# Altium project Strawberry Pi.PrjPcb (part 1 of 2)
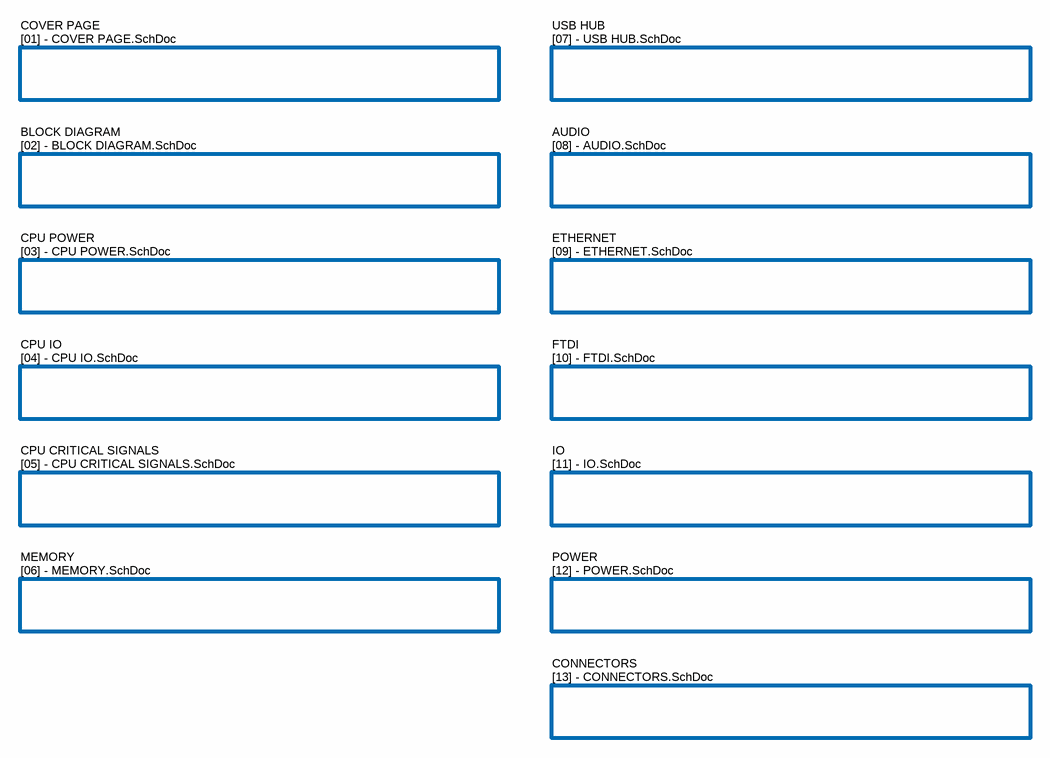
[diagram p0: Strawberry Pi.SchDoc]
15 sheets, 249 parts. Net scope: flat (ports and power ports of the same name join across sheets).
Board file: Strawberry Pi.PcbDoc
Sheets:
  Strawberry Pi.SchDoc
    COVER PAGE = [01] - COVER PAGE.SchDoc
    BLOCK DIAGRAM = [02] - BLOCK DIAGRAM.SchDoc
    CPU POWER = [03] - CPU POWER.SchDoc
    CPU IO = [04] - CPU IO.SchDoc
    CPU CRITICAL SIGNALS = [05] - CPU CRITICAL SIGNALS.SchDoc
    MEMORY = [06] - MEMORY.SchDoc
    USB HUB = [07] - USB HUB.SchDoc
    AUDIO = [08] - AUDIO.SchDoc
    ETHERNET = [09] - ETHERNET.SchDoc
    FTDI = [10] - FTDI.SchDoc
    IO = [11] - IO.SchDoc
    POWER = [12] - POWER.SchDoc
    CONNECTORS = [13] - CONNECTORS.SchDoc
  [14] - CO-PROCESSOR.SchDoc

## Sheet Strawberry Pi.SchDoc: Strawberry Pi
size A4; Organization: Bjørn T. Brodtkorb; Address1: Frode Rinnans veg 161; Address2: 7050 Trondheim; DocumentNumber: 6598; Revision: 1.0; SheetNumber: 1; SheetTotal: 1

### Sub-sheets
AUDIO = [08] - AUDIO.SchDoc: no entries
BLOCK DIAGRAM = [02] - BLOCK DIAGRAM.SchDoc: no entries
CONNECTORS = [13] - CONNECTORS.SchDoc: no entries
COVER PAGE = [01] - COVER PAGE.SchDoc: no entries
CPU CRITICAL SIGNALS = [05] - CPU CRITICAL SIGNALS.SchDoc: no entries
CPU IO = [04] - CPU IO.SchDoc: no entries
CPU POWER = [03] - CPU POWER.SchDoc: no entries
ETHERNET = [09] - ETHERNET.SchDoc: no entries
FTDI = [10] - FTDI.SchDoc: no entries
IO = [11] - IO.SchDoc: no entries
MEMORY = [06] - MEMORY.SchDoc: no entries
POWER = [12] - POWER.SchDoc: no entries
USB HUB = [07] - USB HUB.SchDoc: no entries

### Notes on the sheet
- Title
- Size:
- A4
- Number:
- Revision:
- Date:
- File:
- Time:
- Sheet
- of

## Sheet [01] - COVER PAGE.SchDoc: DOCUMENT TITLE
size A4; Organization: Bjørn T. Brodtkorb; Address1: Frode Rinnans veg 161; Address2: 7050 Trondheim; DocumentNumber: 6598; Revision: 1.0; SheetNumber: 1; SheetTotal: 1
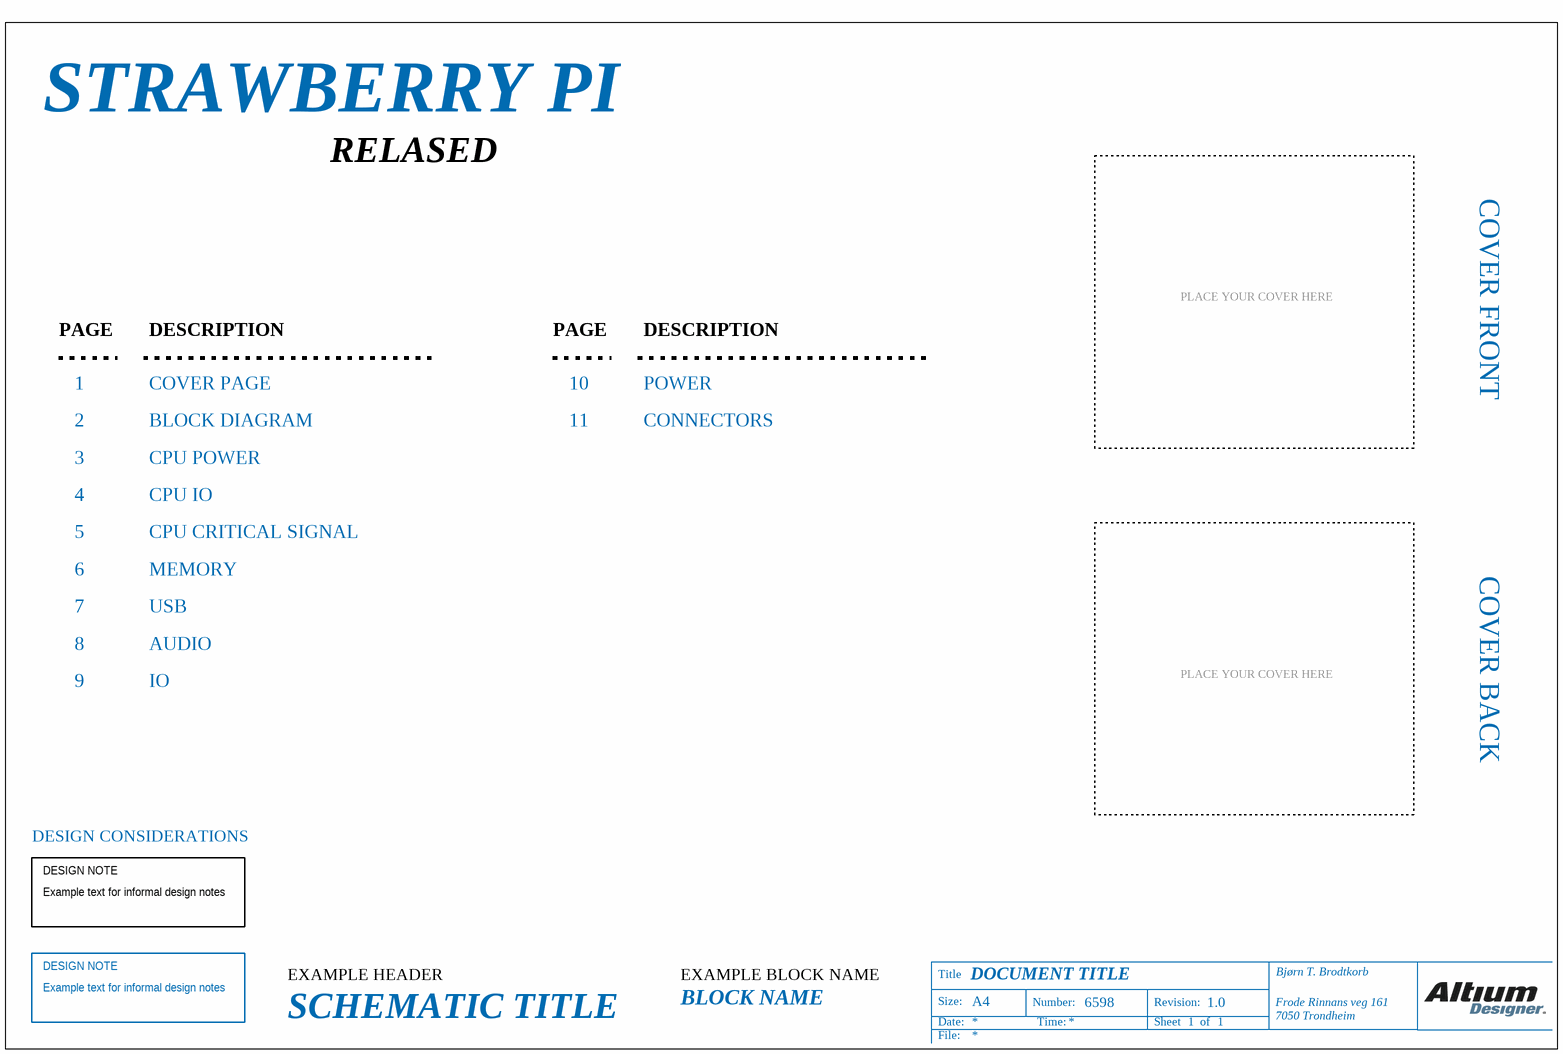
[diagram p1: [01] - COVER PAGE.SchDoc]

### Notes on the sheet
- STRAWBERRY PI
- RELASED
- COVER FRONT
- PLACE YOUR COVER HERE
- PAGE
- 1
- DESCRIPTION
- COVER PAGE
- 10
- POWER
- 2
- 3
- BLOCK DIAGRAM
- CPU POWER
- 11
- CONNECTORS
- 4
- CPU IO
- 5
- 6
- CPU CRITICAL SIGNAL
- MEMORY
- COVER BACK
- 7
- 8
- USB
- AUDIO
- 9
- IO
- DESIGN CONSIDERATIONS
- DESIGN NOTE
- Example text for informal design notes
- EXAMPLE HEADER
- BLOCK NAME
- EXAMPLE BLOCK NAME
- SCHEMATIC TITLE
- Title
- Size:
- A4
- Number:
- Revision:
- Date:
- File:
- Time:
- Sheet
- of

## Sheet [02] - BLOCK DIAGRAM.SchDoc: BLOCK DIAGRAM
size A4; Organization: Bjørn T. Brodtkorb; Address1: Frode Rinnans veg 161; Address2: 7050 Trondheim; DocumentNumber: 6598; Revision: 1.0; SheetNumber: 1; SheetTotal: 1
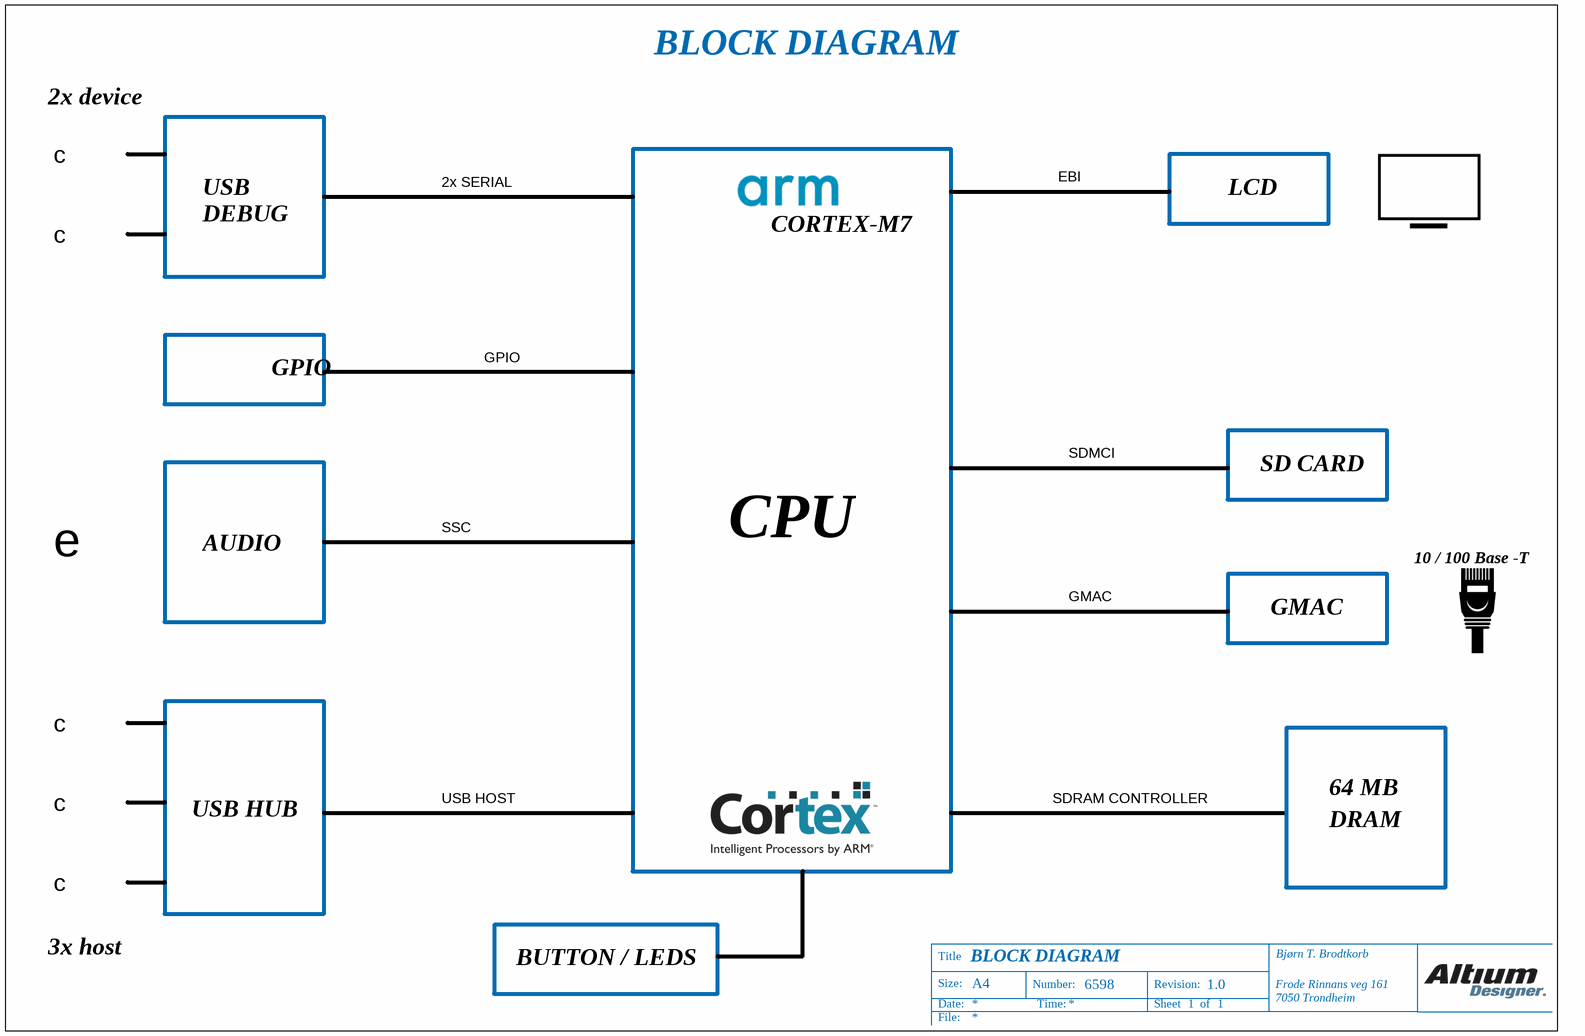
[diagram p2: [02] - BLOCK DIAGRAM.SchDoc]

### Notes on the sheet
- 2x device
- BLOCK DIAGRAM
- c
- EBI
- DEBUG
- USB
- 2x SERIAL
- CORTEX-M7
- LCD
- GPIO
- SDMCI
- SD CARD
- e
- AUDIO
- SSC
- CPU
- 10 / 100 Base -T
- GMAC
- USB HUB
- USB HOST
- SDRAM CONTROLLER
- DRAM
- 64 MB
- 3x host
- BUTTON / LEDS
- Title
- Size:
- A4
- Number:
- Revision:
- Date:
- File:
- Time:
- Sheet
- of

## Sheet [03] - CPU POWER.SchDoc: CPU POWER
size A4; Organization: Bjørn T. Brodtkorb; Address1: Frode Rinnans veg 161; Address2: 7050 Trondheim; DocumentNumber: 6598; Revision: 1.0; SheetNumber: 1; SheetTotal: 1
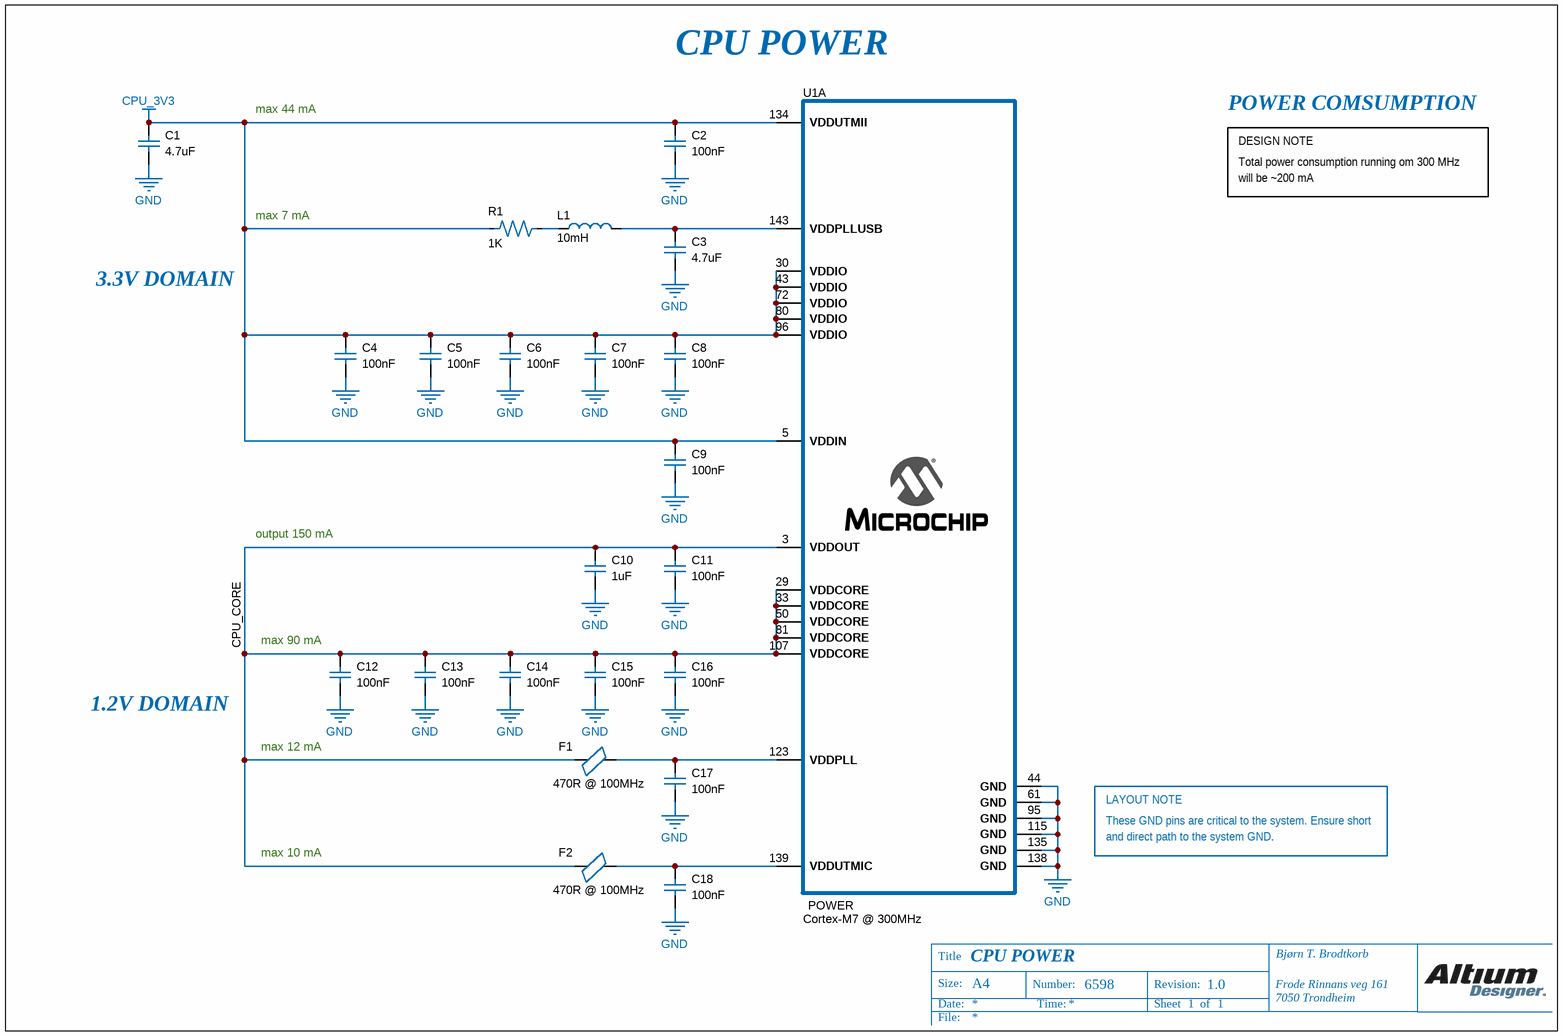
[diagram p3: [03] - CPU POWER.SchDoc]

### Parts
C1  value 4.7uF  [C0603]  (hidden comment: 02016D104KAT2A)
C2  value 100nF  [C0402]  (hidden comment: 04023C103KAT2A)
C3  value 4.7uF  [C0402]  (hidden comment: 04023C103KAT2A)
C4  value 100nF  [C0402]  (hidden comment: 04023C103KAT2A)
C5  value 100nF  [C0402]  (hidden comment: 04023C103KAT2A)
C6  value 100nF  [C0402]  (hidden comment: 04023C103KAT2A)
C7  value 100nF  [C0402]  (hidden comment: 04023C103KAT2A)
C8  value 100nF  [C0402]  (hidden comment: 04023C103KAT2A)
C9  value 100nF  [C0402]  (hidden comment: 04023C103KAT2A)
C10  value 1uF  [C0402]  (hidden comment: 04023C103KAT2A)
C11  value 100nF  [C0402]  (hidden comment: 04023C103KAT2A)
C12  value 100nF  [C0402]  (hidden comment: 04023C103KAT2A)
C13  value 100nF  [C0402]  (hidden comment: 04023C103KAT2A)
C14  value 100nF  [C0402]  (hidden comment: 04023C103KAT2A)
C15  value 100nF  [C0402]  (hidden comment: 04023C103KAT2A)
C16  value 100nF  [C0402]  (hidden comment: 04023C103KAT2A)
C17  value 100nF  [C0402]  (hidden comment: 04023C103KAT2A)
C18  value 100nF  [C0402]  (hidden comment: 04023C103KAT2A)
F1  value 470R @ 100MHz  [Ferrite bead 0402]  (hidden comment: BLM15AG102SN1D)
F2  value 470R @ 100MHz  [Ferrite bead 0402]  (hidden comment: BLM15AG102SN1D)
L1  value 10mH  [Inductor 0603]  (hidden comment: MLZ1608A2R2WT)
R1  value 1K  [R0402]  (hidden comment: CRCW04020000Z0ED)
U1  Cortex-M7 @ 300MHz  [ATSAMS70Q21A-AN]  (part A of 3)

### Nets
CPU_3V3: C1.1 C2.2 C4.2 C5.2 C6.2 C7.2 C8.2 C9.2 R1.1 U1.5(VDDIN) U1.30(VDDIO) U1.43(VDDIO) U1.72(VDDIO) U1.80(VDDIO) U1.96(VDDIO) U1.134(VDDUTMII)
GND: C1.2 C2.1 C3.1 C4.1 C5.1 C6.1 C7.1 C8.1 C9.1 C10.1 C11.1 C12.1 C13.1 C14.1 C15.1 C16.1 C17.1 C18.1 U1.44(GND) U1.61(GND) U1.95(GND) U1.115(GND) U1.135(GND) U1.138(GND)
CPU_CORE: C10.2 C11.2 C12.2 C13.2 C14.2 C15.2 C16.2 F1.1 F2.1 U1.3(VDDOUT) U1.29(VDDCORE) U1.33(VDDCORE) U1.50(VDDCORE) U1.81(VDDCORE) U1.107(VDDCORE)
NetC3_2: C3.2 L1.2 U1.143(VDDPLLUSB)
NetC17_2: C17.2 F1.2 U1.123(VDDPLL)
NetC18_2: C18.2 F2.2 U1.139(VDDUTMIC)
NetL1_1: L1.1 R1.2

### Notes on the sheet
- max 44 mA
- CPU POWER
- POWER COMSUMPTION
- DESIGN NOTE
- Total power consumption running om 300 MHz
- will be ~200 mA
- max 7 mA
- 3.3V DOMAIN
- output 150 mA
- (near C12) max 90 mA
- 1.2V DOMAIN
- (near C12) max 12 mA
- max 10 mA
- LAYOUT NOTE
- These GND pins are critical to the system. Ensure short
- and direct path to the system GND.
- Title
- Size:
- A4
- Number:
- Revision:
- Date:
- File:
- Time:
- Sheet
- of
- (in symbol ATSAMS70Q21A-AN, part A) POWER

### Library data of the parts
C1 = 02016D104KAT2A: C0603
C2-C18 = 04023C103KAT2A: C0402
F1 F2 = BLM15AG102SN1D: Ferrite bead 0402
L1 = MLZ1608A2R2WT: Inductor 0603
R1 = CRCW04020000Z0ED: R0402
U1 = ATSAMS70Q21A-AN: ATSAMS70Q21; Supplier Part Number 1: 2484397; Supplier 1: Farnell

## Sheet [04] - CPU IO.SchDoc: DOCUMENT TITLE
size A3; Organization: Bjørn T. Brodtkorb; Address1: Frode Rinnans veg 161; Address2: 7050 Trondheim; DocumentNumber: 6598; Revision: 1.0; SheetNumber: 1; SheetTotal: 1
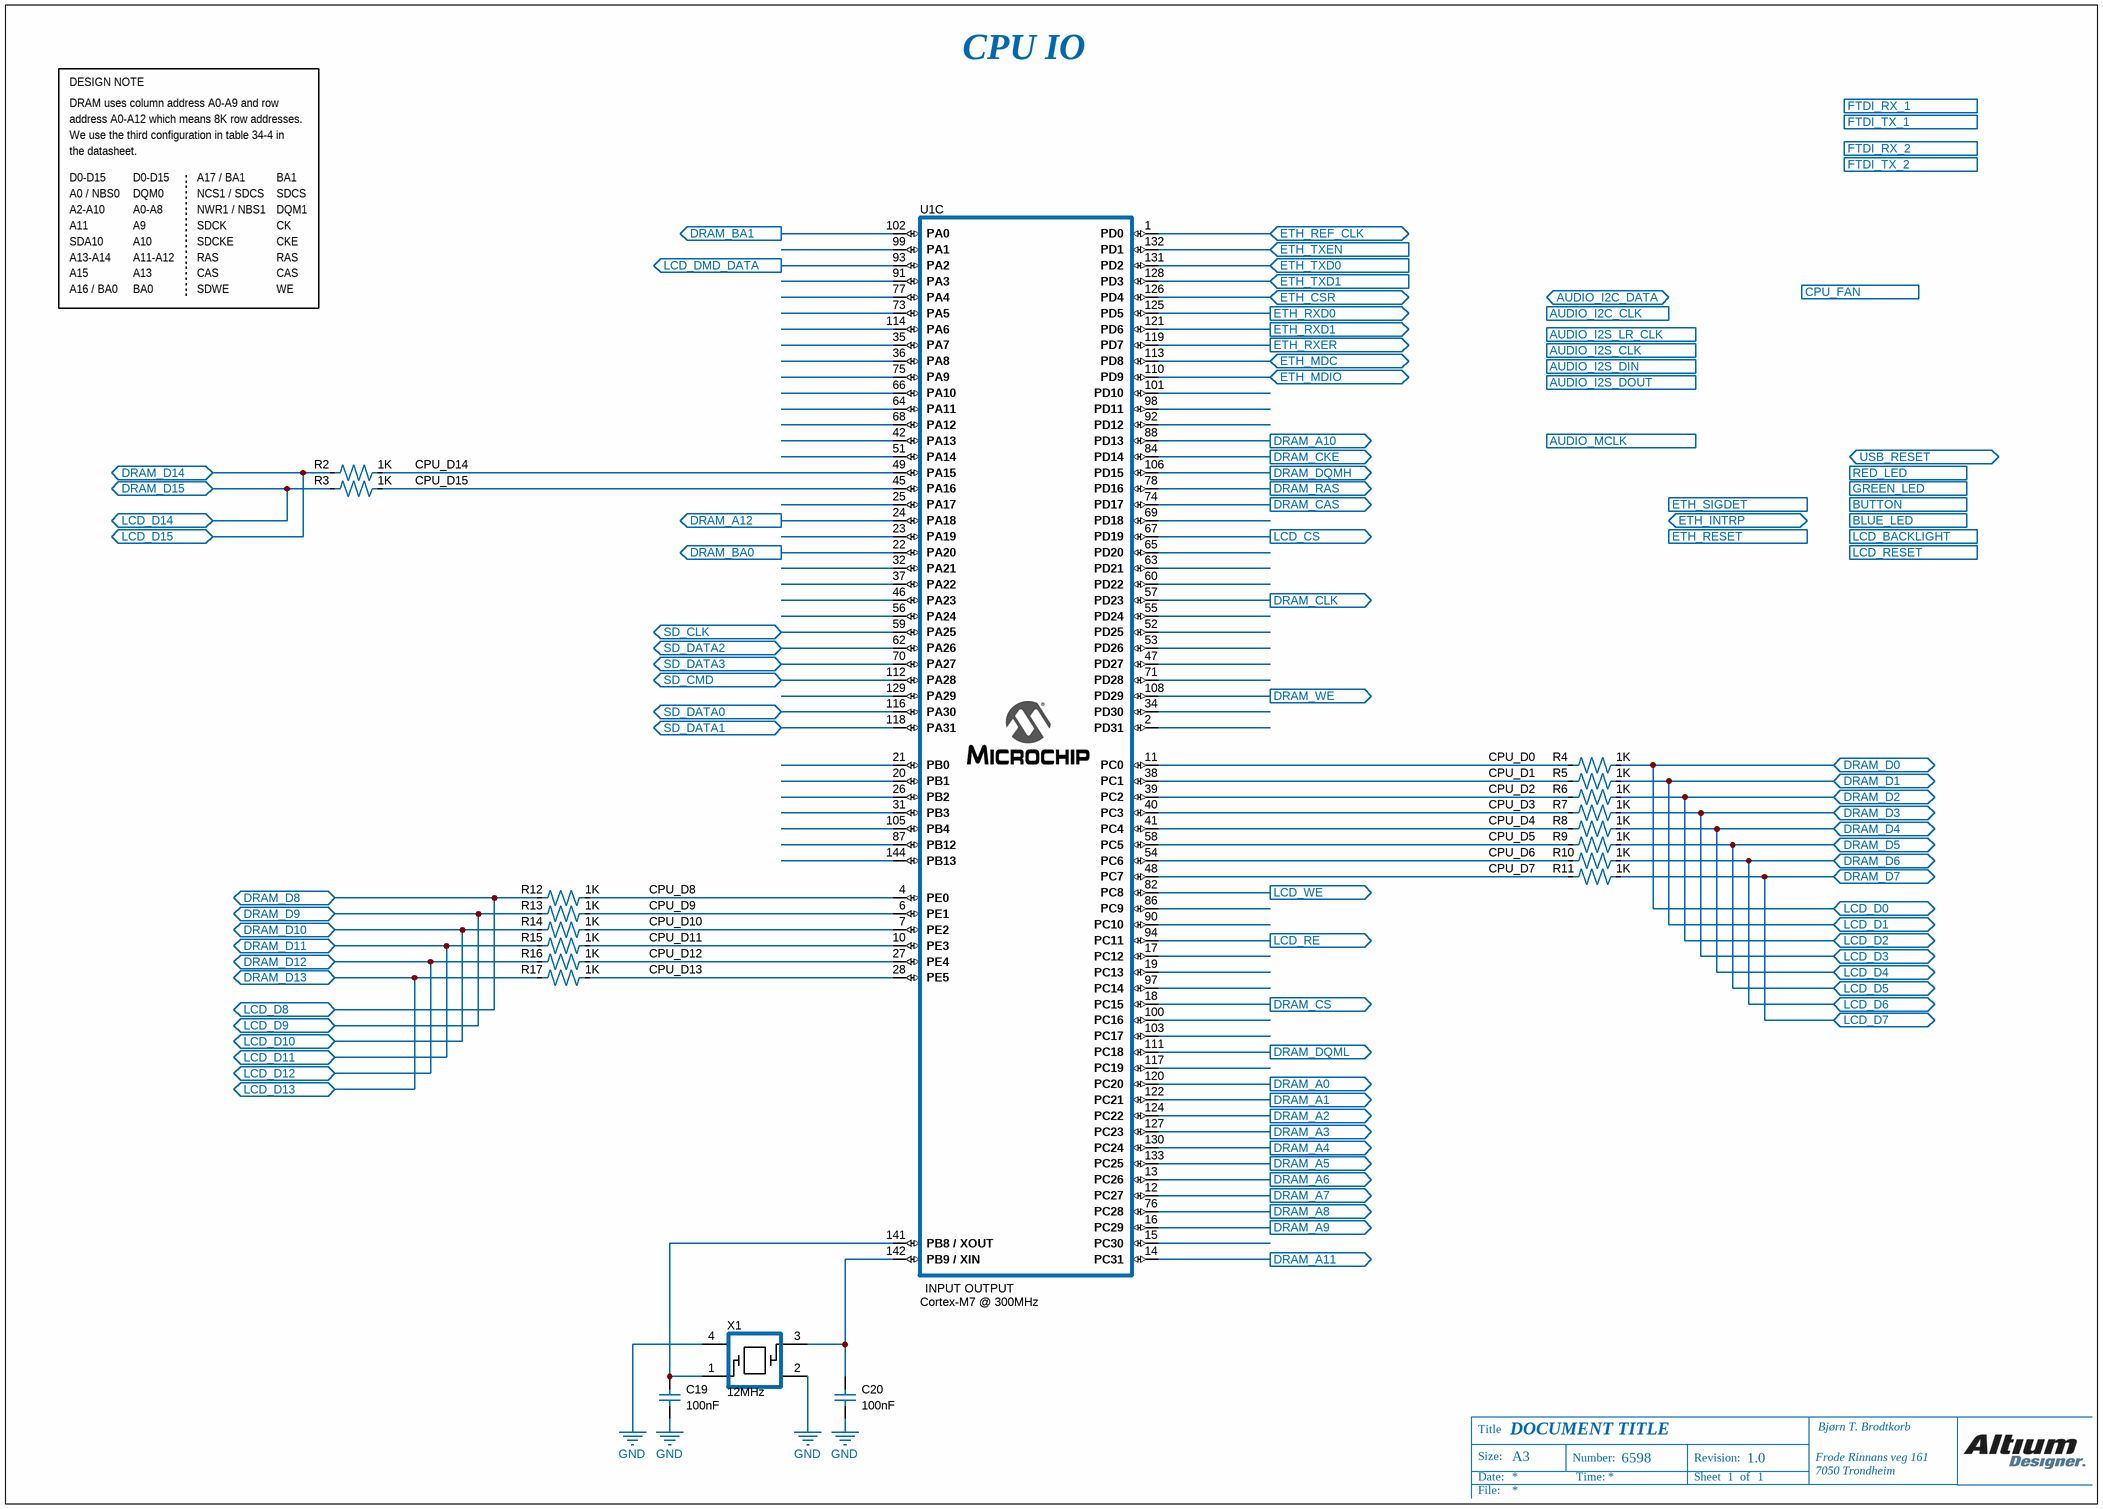
[diagram p4: [04] - CPU IO.SchDoc]

### Parts
C19  value 100nF  [C0402]  (hidden comment: 04023C103KAT2A)
C20  value 100nF  [C0402]  (hidden comment: 04023C103KAT2A)
R2  value 1K  [R0402]  (hidden comment: CRCW04020000Z0ED)
R3  value 1K  [R0402]  (hidden comment: CRCW04020000Z0ED)
R4  value 1K  [R0402]  (hidden comment: CRCW04020000Z0ED)
R5  value 1K  [R0402]  (hidden comment: CRCW04020000Z0ED)
R6  value 1K  [R0402]  (hidden comment: CRCW04020000Z0ED)
R7  value 1K  [R0402]  (hidden comment: CRCW04020000Z0ED)
R8  value 1K  [R0402]  (hidden comment: CRCW04020000Z0ED)
R9  value 1K  [R0402]  (hidden comment: CRCW04020000Z0ED)
R10  value 1K  [R0402]  (hidden comment: CRCW04020000Z0ED)
R11  value 1K  [R0402]  (hidden comment: CRCW04020000Z0ED)
R12  value 1K  [R0402]  (hidden comment: CRCW04020000Z0ED)
R13  value 1K  [R0402]  (hidden comment: CRCW04020000Z0ED)
R14  value 1K  [R0402]  (hidden comment: CRCW04020000Z0ED)
R15  value 1K  [R0402]  (hidden comment: CRCW04020000Z0ED)
R16  value 1K  [R0402]  (hidden comment: CRCW04020000Z0ED)
R17  value 1K  [R0402]  (hidden comment: CRCW04020000Z0ED)
U1  Cortex-M7 @ 300MHz  [ATSAMS70Q21A-AN]  (part C of 3)
X1  12MHz  [MCSJK-7U-12.00-12-30-80-B-30]

### Ports
AUDIO_I2C_CLK (in), AUDIO_I2C_DATA (bidir), AUDIO_I2S_CLK (in), AUDIO_I2S_DIN (in), AUDIO_I2S_DOUT (out), AUDIO_I2S_LR_CLK (in), AUDIO_MCLK (in), BLUE_LED (out), BUTTON (out), CPU_FAN (in), DRAM_A0 (out), DRAM_A1 (out), DRAM_A2 (out), DRAM_A3 (out), DRAM_A4 (out), DRAM_A5 (out), DRAM_A6 (out), DRAM_A7 (out), DRAM_A8 (out), DRAM_A9 (out), DRAM_A10 (out), DRAM_A11 (out), DRAM_A12 (out), DRAM_BA0 (out), DRAM_BA1 (out), DRAM_CAS (out), DRAM_CKE (out), DRAM_CLK (out), DRAM_CS (out), DRAM_D0 (bidir), DRAM_D1 (bidir), DRAM_D2 (bidir), DRAM_D3 (bidir), DRAM_D4 (bidir), DRAM_D5 (bidir), DRAM_D6 (bidir), DRAM_D7 (bidir), DRAM_D8 (bidir), DRAM_D9 (bidir), DRAM_D10 (bidir), DRAM_D11 (bidir), DRAM_D12 (bidir), DRAM_D13 (bidir), DRAM_D14 (bidir), DRAM_D15 (bidir), DRAM_DQMH (out), DRAM_DQML (out), DRAM_RAS (out), DRAM_WE (out), ETH_CSR (bidir), ETH_INTRP (bidir), ETH_MDC (bidir), ETH_MDIO (bidir), ETH_REF_CLK (bidir), ETH_RESET (in), ETH_RXD0 (out), ETH_RXD1 (out), ETH_RXER (out), ETH_SIGDET (in), ETH_TXD0 (in), ETH_TXD1 (in), ETH_TXEN (in), FTDI_RX_1 (out), FTDI_RX_2 (out), FTDI_TX_1 (in), FTDI_TX_2 (in), GREEN_LED (out), LCD_BACKLIGHT (in), LCD_CS (out), LCD_D0 (bidir), LCD_D1 (bidir), LCD_D2 (bidir), LCD_D3 (bidir), LCD_D4 (bidir), LCD_D5 (bidir), LCD_D6 (bidir), LCD_D7 (bidir), LCD_D8 (bidir), LCD_D9 (bidir), LCD_D10 (bidir), LCD_D11 (bidir), LCD_D12 (bidir), LCD_D13 (bidir), LCD_D14 (bidir), LCD_D15 (bidir), LCD_DMD_DATA (out), LCD_RE (out), LCD_RESET (in), LCD_WE (out), RED_LED (out), SD_CLK (bidir), SD_CMD (bidir), SD_DATA0 (bidir), SD_DATA1 (bidir), SD_DATA2 (bidir), SD_DATA3 (bidir), USB_RESET (bidir)

### Nets
GND: C19.1 C20.1 X1.2 X1.4
CPU_D0: R4.2 U1.11(PC0)
CPU_D1: R5.2 U1.38(PC1)
CPU_D2: R6.2 U1.39(PC2)
CPU_D3: R7.2 U1.40(PC3)
CPU_D4: R8.2 U1.41(PC4)
CPU_D5: R9.2 U1.58(PC5)
CPU_D6: R10.2 U1.54(PC6)
CPU_D7: R11.2 U1.48(PC7)
CPU_D8: R12.1 U1.4(PE0)
CPU_D9: R13.1 U1.6(PE1)
CPU_D10: R14.1 U1.7(PE2)
CPU_D11: R15.1 U1.10(PE3)
CPU_D12: R16.1 U1.27(PE4)
CPU_D13: R17.1 U1.28(PE5)
CPU_D14: R2.1 U1.49(PA15)
CPU_D15: R3.1 U1.45(PA16)
DRAM_A0: U1.120(PC20) ; port DRAM_A0
DRAM_A1: U1.122(PC21) ; port DRAM_A1
DRAM_A2: U1.124(PC22) ; port DRAM_A2
DRAM_A3: U1.127(PC23) ; port DRAM_A3
DRAM_A4: U1.130(PC24) ; port DRAM_A4
DRAM_A5: U1.133(PC25) ; port DRAM_A5
DRAM_A6: U1.13(PC26) ; port DRAM_A6
DRAM_A7: U1.12(PC27) ; port DRAM_A7
DRAM_A8: U1.76(PC28) ; port DRAM_A8
DRAM_A9: U1.16(PC29) ; port DRAM_A9
DRAM_A10: U1.88(PD13) ; port DRAM_A10
DRAM_A11: U1.14(PC31) ; port DRAM_A11
DRAM_A12: U1.24(PA18) ; port DRAM_A12
DRAM_BA0: U1.22(PA20) ; port DRAM_BA0
DRAM_BA1: U1.102(PA0) ; port DRAM_BA1
DRAM_CAS: U1.74(PD17) ; port DRAM_CAS
DRAM_CKE: U1.84(PD14) ; port DRAM_CKE
DRAM_CLK: U1.57(PD23) ; port DRAM_CLK
DRAM_CS: U1.18(PC15) ; port DRAM_CS
DRAM_D0: R4.1 ; port DRAM_D0, port LCD_D0
DRAM_D1: R5.1 ; port DRAM_D1, port LCD_D1
DRAM_D2: R6.1 ; port DRAM_D2, port LCD_D2
DRAM_D3: R7.1 ; port DRAM_D3, port LCD_D3
DRAM_D4: R8.1 ; port DRAM_D4, port LCD_D4
DRAM_D5: R9.1 ; port DRAM_D5, port LCD_D5
DRAM_D6: R10.1 ; port DRAM_D6, port LCD_D6
DRAM_D7: R11.1 ; port DRAM_D7, port LCD_D7
DRAM_D8: R12.2 ; port DRAM_D8, port LCD_D8
DRAM_D9: R13.2 ; port DRAM_D9, port LCD_D9
DRAM_D10: R14.2 ; port DRAM_D10, port LCD_D10
DRAM_D11: R15.2 ; port DRAM_D11, port LCD_D11
DRAM_D12: R16.2 ; port DRAM_D12, port LCD_D12
DRAM_D13: R17.2 ; port DRAM_D13, port LCD_D13
DRAM_D14: R2.2 ; port DRAM_D14, port LCD_D15
DRAM_D15: R3.2 ; port DRAM_D15, port LCD_D14
DRAM_DQMH: U1.106(PD15) ; port DRAM_DQMH
DRAM_DQML: U1.111(PC18) ; port DRAM_DQML
DRAM_RAS: U1.78(PD16) ; port DRAM_RAS
DRAM_WE: U1.108(PD29) ; port DRAM_WE
ETH_CSR: U1.126(PD4) ; port ETH_CSR
ETH_MDC: U1.113(PD8) ; port ETH_MDC
ETH_MDIO: U1.110(PD9) ; port ETH_MDIO
ETH_REF_CLK: U1.1(PD0) ; port ETH_REF_CLK
ETH_RXD0: U1.125(PD5) ; port ETH_RXD0
ETH_RXD1: U1.121(PD6) ; port ETH_RXD1
ETH_RXER: U1.119(PD7) ; port ETH_RXER
ETH_TXD0: U1.131(PD2) ; port ETH_TXD0
ETH_TXD1: U1.128(PD3) ; port ETH_TXD1
ETH_TXEN: U1.132(PD1) ; port ETH_TXEN
LCD_CMD_DATA: U1.93(PA2) ; port LCD_DMD_DATA
LCD_CS: U1.67(PD19) ; port LCD_CS
LCD_RE: U1.94(PC11) ; port LCD_RE
LCD_WE: U1.82(PC8) ; port LCD_WE
NetC19_2: C19.2 U1.141(PB8_/_XOUT) X1.1
NetC20_2: C20.2 U1.142(PB9_/_XIN) X1.3
NetJ12_1: U1.62(PA26) ; port SD_DATA2
NetJ12_2: U1.70(PA27) ; port SD_DATA3
NetJ12_3: U1.112(PA28) ; port SD_CMD
NetJ12_5: U1.59(PA25) ; port SD_CLK
NetJ12_7: U1.116(PA30) ; port SD_DATA0
NetJ12_8: U1.118(PA31) ; port SD_DATA1

Not connected (* = marked no-connect by the designer): U1 2(PD31) 15(PC30) 17(PC12) 19(PC13) 20(PB1) 21(PB0) 23(PA19) 25(PA17) 26(PB2) 31(PB3) 32(PA21) 34(PD30) 35(PA7) 36(PA8) 37(PA22) 42(PA13) 46(PA23) 47(PD27) 51(PA14) 52(PD25) 53(PD26) 55(PD24) 56(PA24) 60(PD22) 63(PD21) 64(PA11) 65(PD20) 66(PA10) 68(PA12) 69(PD18) 71(PD28) 73(PA5) 75(PA9) 77(PA4) 86(PC9) 87(PB12) 90(PC10) 91(PA3) 92(PD12) 97(PC14) 98(PD11) 99(PA1) 100(PC16) 101(PD10) 103(PC17) 105(PB4) 114(PA6) 117(PC19) 129(PA29) 144(PB13)

### Notes on the sheet
- DESIGN NOTE
- DRAM uses column address A0-A9 and row
- CPU IO
- address A0-A12 which means 8K row addresses.
- We use the third configuration in table 34-4 in
- the datasheet.
- D0-D15
- A17 / BA1
- BA1
- A0 / NBS0
- A2-A10
- A11
- SDA10
- DQM0
- A0-A8
- A9
- A10
- NCS1 / SDCS
- NWR1 / NBS1
- SDCK
- SDCKE
- SDCS
- DQM1
- CK
- CKE
- A13-A14
- A15
- A16 / BA0
- A11-A12
- A13
- BA0
- RAS
- CAS
- SDWE
- WE
- Title
- Size:
- A3
- Number:
- Revision:
- Date:
- File:
- Time:
- Sheet
- of
- (in symbol ATSAMS70Q21A-AN, part C) INPUT OUTPUT

### Library data of the parts
C19 C20 = 04023C103KAT2A: C0402
R2-R17 = CRCW04020000Z0ED: R0402
U1 = ATSAMS70Q21A-AN: ATSAMS70Q21; Supplier Part Number 1: 2484397; Supplier 1: Farnell
X1 = MCSJK-7U-12.00-12-30-80-B-30: Crystal 12MHz 3.2mm x 2.5mm; Supplier Part Number 1: 2853917; Supplier 1: Farnell

## Sheet [05] - CPU CRITICAL SIGNALS.SchDoc: CPU CRITICAL SIGNALS
size A4; Organization: Bjørn T. Brodtkorb; Address1: Frode Rinnans veg 161; Address2: 7050 Trondheim; DocumentNumber: 6598; Revision: 1.0; SheetNumber: 1; SheetTotal: 1
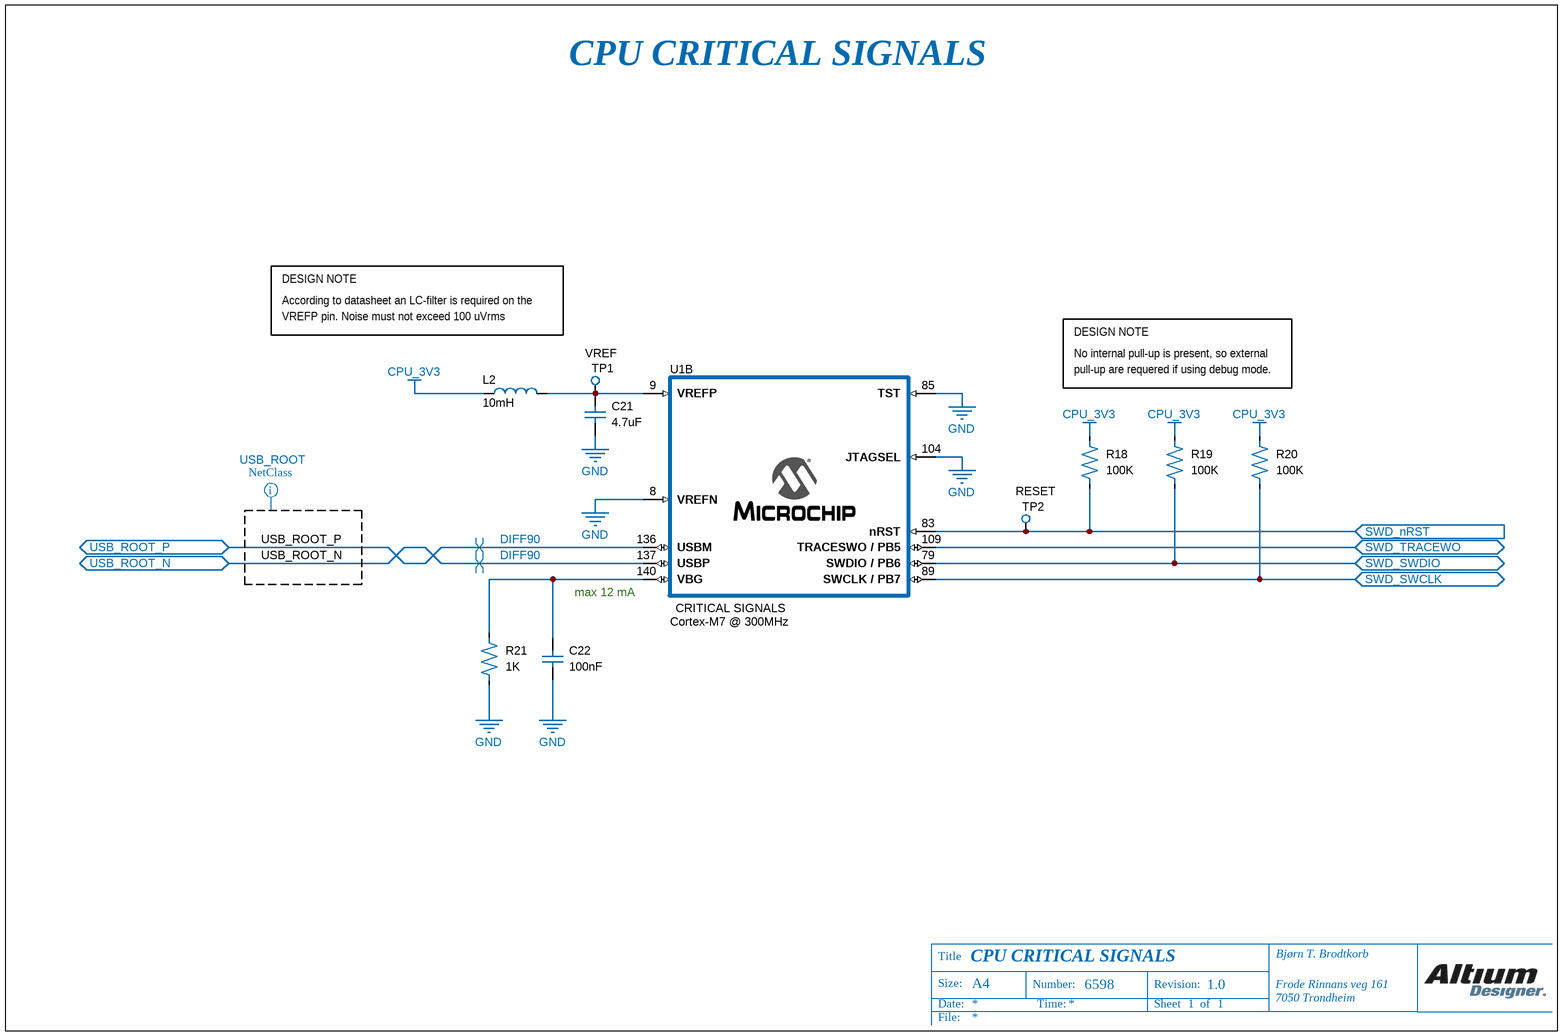
[diagram p5: [05] - CPU CRITICAL SIGNALS.SchDoc]

### Parts
C21  value 4.7uF  [C0603]  (hidden comment: 02016D104KAT2A)
C22  value 100nF  [C0402]  (hidden comment: 04023C103KAT2A)
L2  value 10mH  [Inductor 0603]  (hidden comment: MLZ1608A2R2WT)
R18  value 100K  [R0603]  (hidden comment: CPF-A-0603B100KE1)
R19  value 100K  [R0603]  (hidden comment: CPF-A-0603B100KE1)
R20  value 100K  [R0603]  (hidden comment: CPF-A-0603B100KE1)
R21  value 1K  [R0402]  (hidden comment: CRCW04020000Z0ED)
TP1  Type: VREF  [TEST POINT]  (hidden comment: Test point)
TP2  Type: RESET  [TEST POINT]  (hidden comment: Test point)
U1  Cortex-M7 @ 300MHz  [ATSAMS70Q21A-AN]  (part B of 3)

### Ports
SWD_nRST (in), SWD_SWCLK (bidir), SWD_SWDIO (bidir), SWD_TRACEWO (bidir), USB_ROOT_N (bidir), USB_ROOT_P (bidir)

### Nets
CPU_3V3: L2.1 R18.2 R19.2 R20.2
GND: C21.2 C22.1 R21.2 U1.8(VREFN) U1.85(TST) U1.104(JTAGSEL)
USB_ROOT_N: U1.137(USBP) ; port USB_ROOT_N
USB_ROOT_P: U1.136(USBM) ; port USB_ROOT_P
NetC21_1: C21.1 L2.2 TP1.1 U1.9(VREFP)
NetC22_2: C22.2 R21.1 U1.140(VBG)
NetJ6_2: R18.1 TP2.1 U1.83(nRST) ; port SWD_nRST
NetJ11_2: R19.1 U1.79(SWDIO_/_PB6) ; port SWD_SWDIO
NetJ11_4: R20.1 U1.89(SWCLK_/_PB7) ; port SWD_SWCLK
NetJ11_6: U1.109(TRACESWO_/_PB5) ; port SWD_TRACEWO

### Layout directives
differential pair; differential pair class DIFF90: USB_ROOT_N, USB_ROOT_P
net class USB_ROOT: USB_ROOT_N, USB_ROOT_P

### Notes on the sheet
- CPU CRITICAL SIGNALS
- DESIGN NOTE
- According to datasheet an LC-filter is required on the
- VREFP pin. Noise must not exceed 100 uVrms
- No internal pull-up is present, so external
- pull-up are requered if using debug mode.
- max 12 mA
- Title
- Size:
- A4
- Number:
- Revision:
- Date:
- File:
- Time:
- Sheet
- of
- (in symbol ATSAMS70Q21A-AN, part B) CRITICAL SIGNALS

### Library data of the parts
C21 = 02016D104KAT2A: C0603
C22 = 04023C103KAT2A: C0402
L2 = MLZ1608A2R2WT: Inductor 0603
R18-R20 = CPF-A-0603B100KE1: R0603
R21 = CRCW04020000Z0ED: R0402
U1 = ATSAMS70Q21A-AN: ATSAMS70Q21; Supplier Part Number 1: 2484397; Supplier 1: Farnell

## Sheet [06] - MEMORY.SchDoc: MEMORY
size A4; Organization: Bjørn T. Brodtkorb; Address1: Frode Rinnans veg 161; Address2: 7050 Trondheim; DocumentNumber: 6598; Revision: 1.0; SheetNumber: 1; SheetTotal: 1
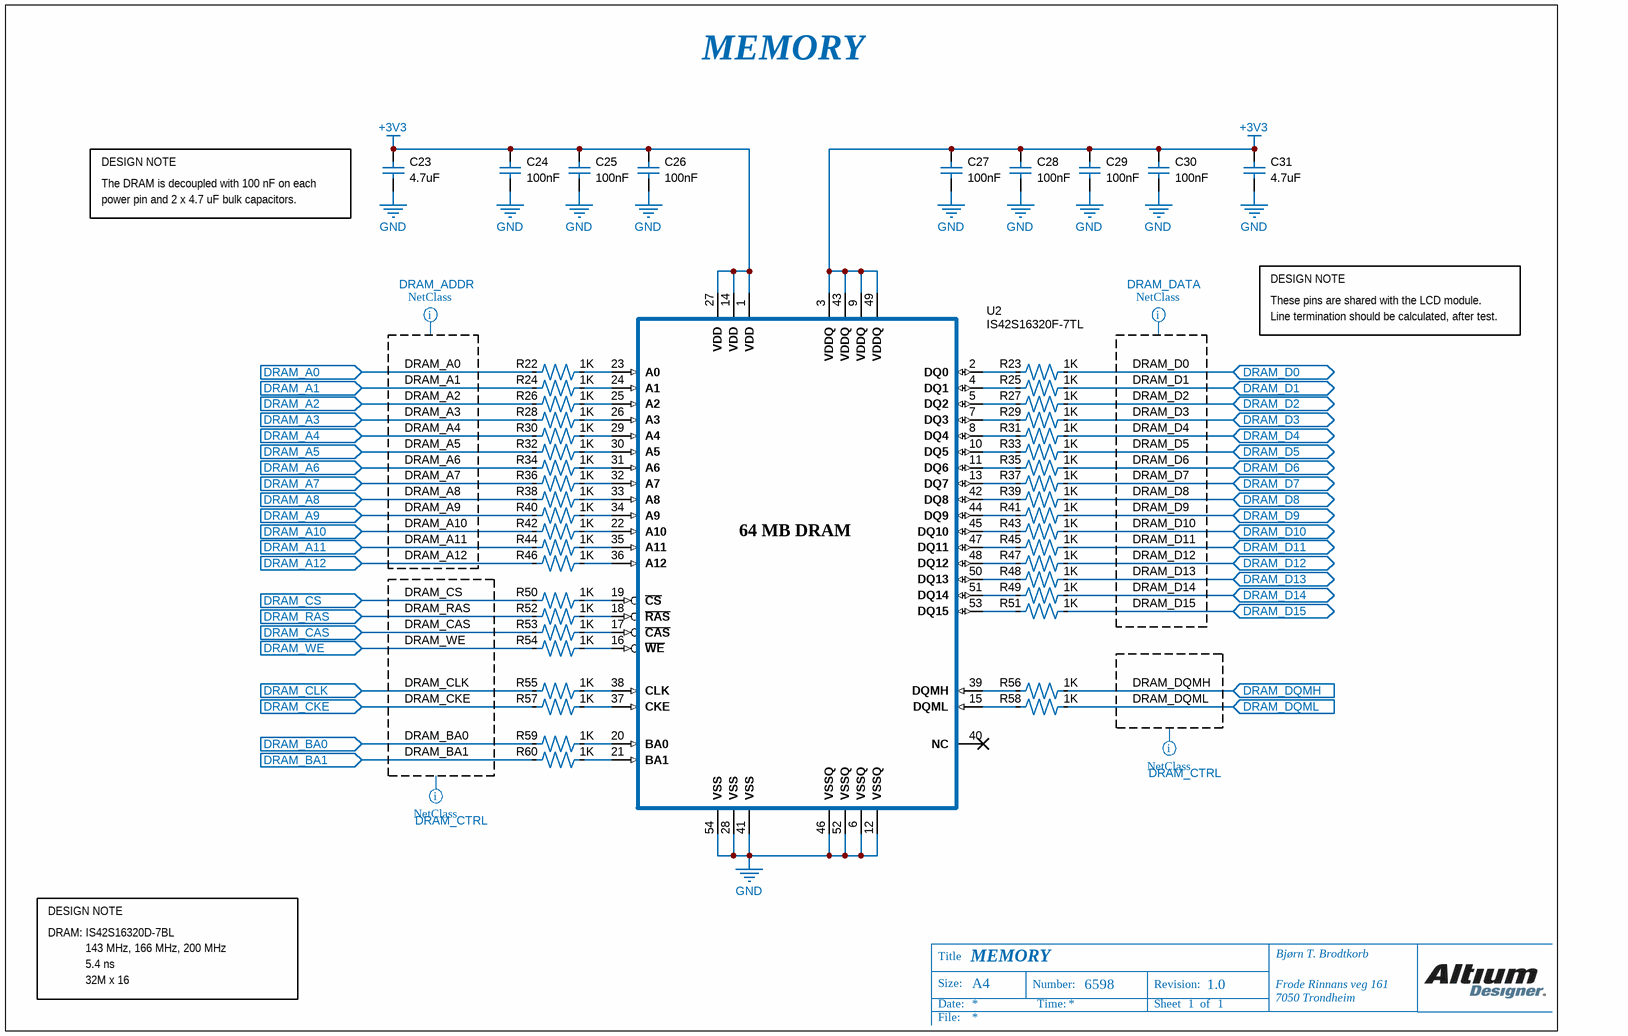
[diagram p6: [06] - MEMORY.SchDoc]

### Parts
C23  value 4.7uF  [C0603]  (hidden comment: 02016D104KAT2A)
C24  value 100nF  [C0402]  (hidden comment: 04023C103KAT2A)
C25  value 100nF  [C0402]  (hidden comment: 04023C103KAT2A)
C26  value 100nF  [C0402]  (hidden comment: 04023C103KAT2A)
C27  value 100nF  [C0402]  (hidden comment: 04023C103KAT2A)
C28  value 100nF  [C0402]  (hidden comment: 04023C103KAT2A)
C29  value 100nF  [C0402]  (hidden comment: 04023C103KAT2A)
C30  value 100nF  [C0402]  (hidden comment: 04023C103KAT2A)
C31  value 4.7uF  [C0603]  (hidden comment: 02016D104KAT2A)
R22  value 1K  [R0402]  (hidden comment: CRCW04020000Z0ED)
R23  value 1K  [R0402]  (hidden comment: CRCW04020000Z0ED)
R24  value 1K  [R0402]  (hidden comment: CRCW04020000Z0ED)
R25  value 1K  [R0402]  (hidden comment: CRCW04020000Z0ED)
R26  value 1K  [R0402]  (hidden comment: CRCW04020000Z0ED)
R27  value 1K  [R0402]  (hidden comment: CRCW04020000Z0ED)
R28  value 1K  [R0402]  (hidden comment: CRCW04020000Z0ED)
R29  value 1K  [R0402]  (hidden comment: CRCW04020000Z0ED)
R30  value 1K  [R0402]  (hidden comment: CRCW04020000Z0ED)
R31  value 1K  [R0402]  (hidden comment: CRCW04020000Z0ED)
R32  value 1K  [R0402]  (hidden comment: CRCW04020000Z0ED)
R33  value 1K  [R0402]  (hidden comment: CRCW04020000Z0ED)
R34  value 1K  [R0402]  (hidden comment: CRCW04020000Z0ED)
R35  value 1K  [R0402]  (hidden comment: CRCW04020000Z0ED)
R36  value 1K  [R0402]  (hidden comment: CRCW04020000Z0ED)
R37  value 1K  [R0402]  (hidden comment: CRCW04020000Z0ED)
R38  value 1K  [R0402]  (hidden comment: CRCW04020000Z0ED)
R39  value 1K  [R0402]  (hidden comment: CRCW04020000Z0ED)
R40  value 1K  [R0402]  (hidden comment: CRCW04020000Z0ED)
R41  value 1K  [R0402]  (hidden comment: CRCW04020000Z0ED)
R42  value 1K  [R0402]  (hidden comment: CRCW04020000Z0ED)
R43  value 1K  [R0402]  (hidden comment: CRCW04020000Z0ED)
R44  value 1K  [R0402]  (hidden comment: CRCW04020000Z0ED)
R45  value 1K  [R0402]  (hidden comment: CRCW04020000Z0ED)
R46  value 1K  [R0402]  (hidden comment: CRCW04020000Z0ED)
R47  value 1K  [R0402]  (hidden comment: CRCW04020000Z0ED)
R48  value 1K  [R0402]  (hidden comment: CRCW04020000Z0ED)
R49  value 1K  [R0402]  (hidden comment: CRCW04020000Z0ED)
R50  value 1K  [R0402]  (hidden comment: CRCW04020000Z0ED)
R51  value 1K  [R0402]  (hidden comment: CRCW04020000Z0ED)
R52  value 1K  [R0402]  (hidden comment: CRCW04020000Z0ED)
R53  value 1K  [R0402]  (hidden comment: CRCW04020000Z0ED)
R54  value 1K  [R0402]  (hidden comment: CRCW04020000Z0ED)
R55  value 1K  [R0402]  (hidden comment: CRCW04020000Z0ED)
R56  value 1K  [R0402]  (hidden comment: CRCW04020000Z0ED)
R57  value 1K  [R0402]  (hidden comment: CRCW04020000Z0ED)
R58  value 1K  [R0402]  (hidden comment: CRCW04020000Z0ED)
R59  value 1K  [R0402]  (hidden comment: CRCW04020000Z0ED)
R60  value 1K  [R0402]  (hidden comment: CRCW04020000Z0ED)
U2  IS42S16320F-7TL  [IS42S16320F-7TL]

### Ports
DRAM_A0 (in), DRAM_A1 (in), DRAM_A2 (in), DRAM_A3 (in), DRAM_A4 (in), DRAM_A5 (in), DRAM_A6 (in), DRAM_A7 (in), DRAM_A8 (in), DRAM_A9 (in), DRAM_A10 (in), DRAM_A11 (in), DRAM_A12 (in), DRAM_BA0 (in), DRAM_BA1 (in), DRAM_CAS (in), DRAM_CKE (in), DRAM_CLK (in), DRAM_CS (in), DRAM_D0 (bidir), DRAM_D1 (bidir), DRAM_D2 (bidir), DRAM_D3 (bidir), DRAM_D4 (bidir), DRAM_D5 (bidir), DRAM_D6 (bidir), DRAM_D7 (bidir), DRAM_D8 (bidir), DRAM_D9 (bidir), DRAM_D10 (bidir), DRAM_D11 (bidir), DRAM_D12 (bidir), DRAM_D13 (bidir), DRAM_D14 (bidir), DRAM_D15 (bidir), DRAM_DQMH (in), DRAM_DQML (in), DRAM_RAS (in), DRAM_WE (in)

### Nets
+3V3: C23.2 C24.2 C25.2 C26.2 C27.2 C28.2 C29.2 C30.2 C31.2 U2.1(VDD) U2.3(VDDQ) U2.9(VDDQ) U2.14(VDD) U2.27(VDD) U2.43(VDDQ) U2.49(VDDQ)
GND: C23.1 C24.1 C25.1 C26.1 C27.1 C28.1 C29.1 C30.1 C31.1 U2.6(VSSQ) U2.12(VSSQ) U2.28(VSS) U2.41(VSS) U2.46(VSSQ) U2.52(VSSQ) U2.54(VSS)
DRAM_A0: R22.1 ; port DRAM_A0
DRAM_A1: R24.1 ; port DRAM_A1
DRAM_A2: R26.1 ; port DRAM_A2
DRAM_A3: R28.1 ; port DRAM_A3
DRAM_A4: R30.1 ; port DRAM_A4
DRAM_A5: R32.1 ; port DRAM_A5
DRAM_A6: R34.1 ; port DRAM_A6
DRAM_A7: R36.1 ; port DRAM_A7
DRAM_A8: R38.1 ; port DRAM_A8
DRAM_A9: R40.1 ; port DRAM_A9
DRAM_A10: R42.1 ; port DRAM_A10
DRAM_A11: R44.1 ; port DRAM_A11
DRAM_A12: R46.1 ; port DRAM_A12
DRAM_BA0: R59.1 ; port DRAM_BA0
DRAM_BA1: R60.1 ; port DRAM_BA1
DRAM_CAS: R53.1 ; port DRAM_CAS
DRAM_CKE: R57.1 ; port DRAM_CKE
DRAM_CLK: R55.1 ; port DRAM_CLK
DRAM_CS: R50.1 ; port DRAM_CS
DRAM_D0: R23.2 ; port DRAM_D0
DRAM_D1: R25.2 ; port DRAM_D1
DRAM_D2: R27.2 ; port DRAM_D2
DRAM_D3: R29.2 ; port DRAM_D3
DRAM_D4: R31.2 ; port DRAM_D4
DRAM_D5: R33.2 ; port DRAM_D5
DRAM_D6: R35.2 ; port DRAM_D6
DRAM_D7: R37.2 ; port DRAM_D7
DRAM_D8: R39.2 ; port DRAM_D8
DRAM_D9: R41.2 ; port DRAM_D9
DRAM_D10: R43.2 ; port DRAM_D10
DRAM_D11: R45.2 ; port DRAM_D11
DRAM_D12: R47.2 ; port DRAM_D12
DRAM_D13: R48.2 ; port DRAM_D13
DRAM_D14: R49.2 ; port DRAM_D14
DRAM_D15: R51.2 ; port DRAM_D15
DRAM_DQMH: R56.2 ; port DRAM_DQMH
DRAM_DQML: R58.2 ; port DRAM_DQML
DRAM_RAS: R52.1 ; port DRAM_RAS
DRAM_WE: R54.1 ; port DRAM_WE
NetR22_2: R22.2 U2.23(A0)
NetR23_1: R23.1 U2.2(DQ0)
NetR24_2: R24.2 U2.24(A1)
NetR25_1: R25.1 U2.4(DQ1)
NetR26_2: R26.2 U2.25(A2)
NetR27_1: R27.1 U2.5(DQ2)
NetR28_2: R28.2 U2.26(A3)
NetR29_1: R29.1 U2.7(DQ3)
NetR30_2: R30.2 U2.29(A4)
NetR31_1: R31.1 U2.8(DQ4)
NetR32_2: R32.2 U2.30(A5)
NetR33_1: R33.1 U2.10(DQ5)
NetR34_2: R34.2 U2.31(A6)
NetR35_1: R35.1 U2.11(DQ6)
NetR36_2: R36.2 U2.32(A7)
NetR37_1: R37.1 U2.13(DQ7)
NetR38_2: R38.2 U2.33(A8)
NetR39_1: R39.1 U2.42(DQ8)
NetR40_2: R40.2 U2.34(A9)
NetR41_1: R41.1 U2.44(DQ9)
NetR42_2: R42.2 U2.22(A10)
NetR43_1: R43.1 U2.45(DQ10)
NetR44_2: R44.2 U2.35(A11)
NetR45_1: R45.1 U2.47(DQ11)
NetR46_2: R46.2 U2.36(A12)
NetR47_1: R47.1 U2.48(DQ12)
NetR48_1: R48.1 U2.50(DQ13)
NetR49_1: R49.1 U2.51(DQ14)
NetR50_2: R50.2 U2.19(~{CS})
NetR51_1: R51.1 U2.53(DQ15)
NetR52_2: R52.2 U2.18(~{RAS})
NetR53_2: R53.2 U2.17(~{CAS})
NetR54_2: R54.2 U2.16(~{WE})
NetR55_2: R55.2 U2.38(CLK)
NetR56_1: R56.1 U2.39(DQMH)
NetR57_2: R57.2 U2.37(CKE)
NetR58_1: R58.1 U2.15(DQML)
NetR59_2: R59.2 U2.20(BA0)
NetR60_2: R60.2 U2.21(BA1)

Not connected (* = marked no-connect by the designer): U2 40(NC)*

### Layout directives
net class DRAM_DATA: DRAM_D0, DRAM_D1, DRAM_D2, DRAM_D3, DRAM_D4, DRAM_D5, DRAM_D6, DRAM_D7, DRAM_D8, DRAM_D9, DRAM_D10, DRAM_D11, DRAM_D12, DRAM_D13, DRAM_D14, DRAM_D15
net class DRAM_ADDR: DRAM_A0, DRAM_A1, DRAM_A2, DRAM_A3, DRAM_A4, DRAM_A5, DRAM_A6, DRAM_A7, DRAM_A8, DRAM_A9, DRAM_A10, DRAM_A11, DRAM_A12
net class DRAM_CTRL: DRAM_BA0, DRAM_BA1, DRAM_CAS, DRAM_CKE, DRAM_CLK, DRAM_CS, DRAM_DQMH, DRAM_DQML, DRAM_RAS, DRAM_WE

### Notes on the sheet
- MEMORY
- DESIGN NOTE
- (near C23) The DRAM is decoupled with 100 nF on each
- (near C23) power pin and 2 x 4.7 uF bulk capacitors.
- These pins are shared with the LCD module.
- Line termination should be calculated, after test.
- DRAM: IS42S16320D-7BL
- 143 MHz, 166 MHz, 200 MHz
- 5.4 ns
- 32M x 16
- Title
- Size:
- A4
- Number:
- Revision:
- Date:
- File:
- Time:
- Sheet
- of
- (in symbol IS42S16320F-7TL) 64 MB DRAM

### Library data of the parts
C23 C31 = 02016D104KAT2A: C0603
C24-C30 = 04023C103KAT2A: C0402
R22-R60 = CRCW04020000Z0ED: R0402
U2 = IS42S16320F-7TL: SDRAM 512Mb 32Mx16 TSOP; Clock cycle time: 7.5 ns; Clock frequency: 143 MHz; Supplier 1: Digi-Key; Supplier Part Number 1: 706-1450-5-ND

## Sheet [07] - USB HUB.SchDoc: USB HUB
size A4; Organization: Bjørn T. Brodtkorb; Address1: Frode Rinnans veg 161; Address2: 7050 Trondheim; DocumentNumber: 6598; Revision: 1.0; SheetNumber: 1; SheetTotal: 1
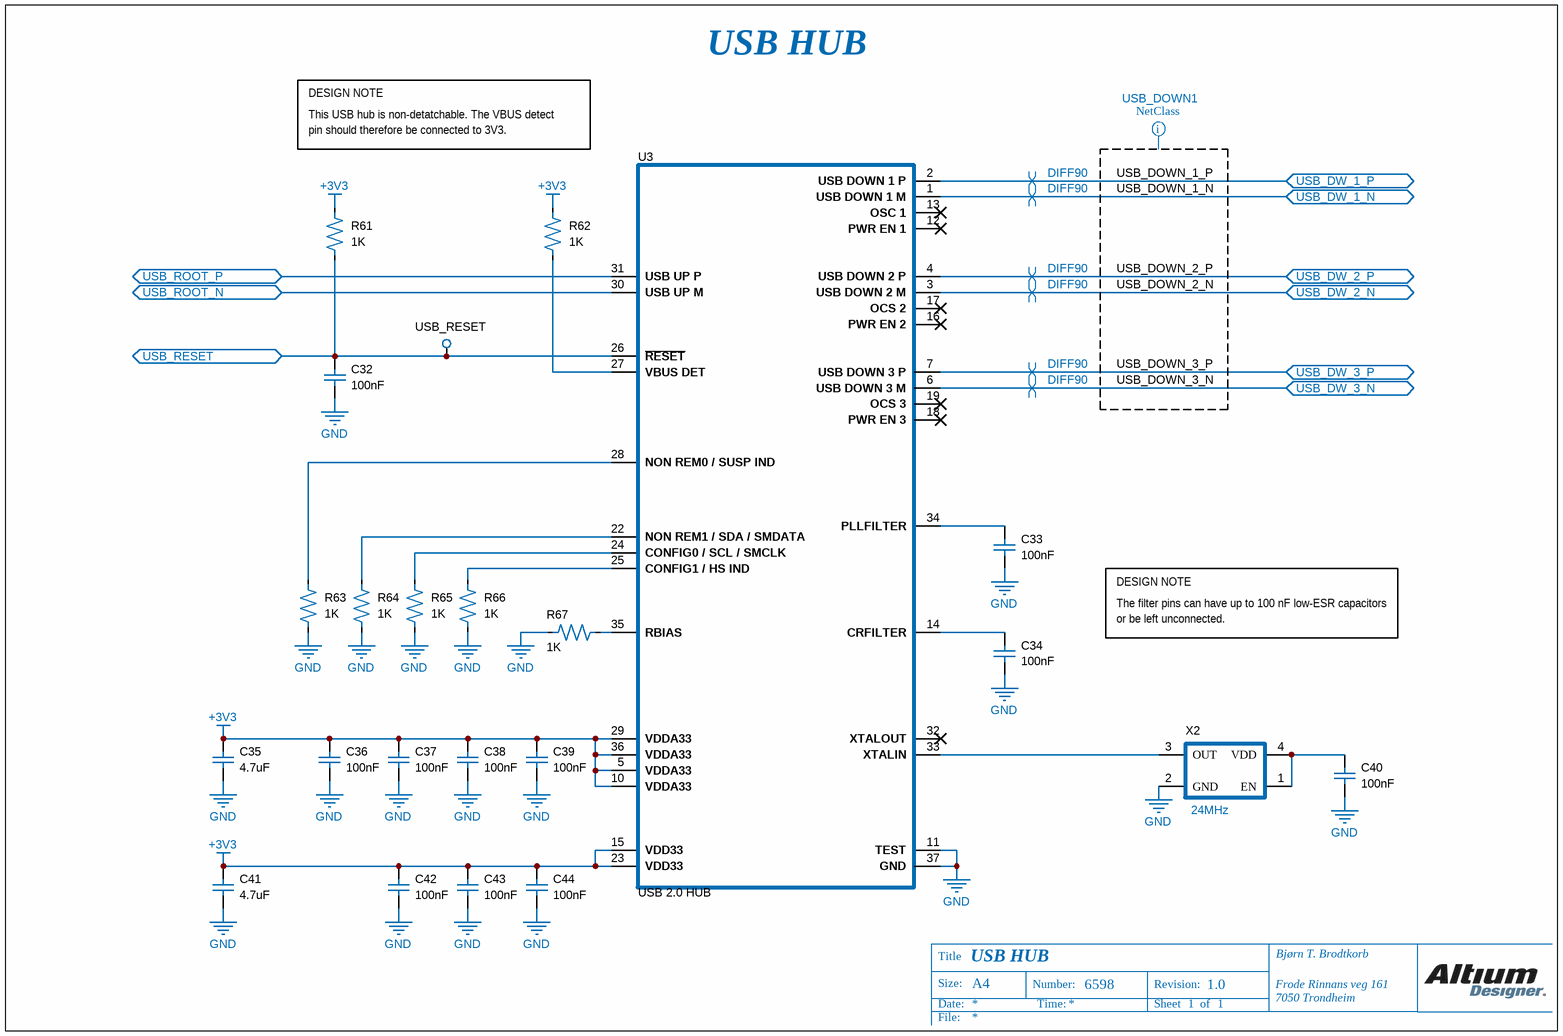
[diagram p7: [07] - USB HUB.SchDoc]

### Parts
C32  value 100nF  [C0402]  (hidden comment: 04023C103KAT2A)
C33  value 100nF  [C0402]  (hidden comment: 04023C103KAT2A)
C34  value 100nF  [C0402]  (hidden comment: 04023C103KAT2A)
C35  value 4.7uF  [C0603]  (hidden comment: 02016D104KAT2A)
C36  value 100nF  [C0402]  (hidden comment: 04023C103KAT2A)
C37  value 100nF  [C0402]  (hidden comment: 04023C103KAT2A)
C38  value 100nF  [C0402]  (hidden comment: 04023C103KAT2A)
C39  value 100nF  [C0402]  (hidden comment: 04023C103KAT2A)
C40  value 100nF  [C0402]  (hidden comment: 04023C103KAT2A)
C41  value 4.7uF  [C0603]  (hidden comment: 02016D104KAT2A)
C42  value 100nF  [C0402]  (hidden comment: 04023C103KAT2A)
C43  value 100nF  [C0402]  (hidden comment: 04023C103KAT2A)
C44  value 100nF  [C0402]  (hidden comment: 04023C103KAT2A)
R61  value 1K  [R0402]  (hidden comment: CRCW04020000Z0ED)
R62  value 1K  [R0402]  (hidden comment: CRCW04020000Z0ED)
R63  value 1K  [R0402]  (hidden comment: CRCW04020000Z0ED)
R64  value 1K  [R0402]  (hidden comment: CRCW04020000Z0ED)
R65  value 1K  [R0402]  (hidden comment: CRCW04020000Z0ED)
R66  value 1K  [R0402]  (hidden comment: CRCW04020000Z0ED)
R67  value 1K  [R0402]  (hidden comment: CRCW04020000Z0ED)
TP3  Type: USB_RESET  [TEST POINT]  (hidden comment: Test point)
U3  USB 2.0 HUB  [USB2512B-I/M2]
X2  value 24MHz  [MCSJK-7U-12.00-12-30-80-B-30]  (hidden comment: X1G0041710031 SG-210STF 24 MHZ L)

### Ports
USB_DW_1_N (bidir), USB_DW_1_P (bidir), USB_DW_2_N (bidir), USB_DW_2_P (bidir), USB_DW_3_N (bidir), USB_DW_3_P (bidir), USB_RESET (bidir), USB_ROOT_N (bidir), USB_ROOT_P (bidir)

### Nets
+3V3: C35.1 C36.2 C37.2 C38.2 C39.2 C41.1 C42.2 C43.2 C44.2 R61.2 R62.2 U3.5(VDDA33) U3.10(VDDA33) U3.15(VDD33) U3.23(VDD33) U3.29(VDDA33) U3.36(VDDA33)
GND: C32.1 C33.1 C34.1 C35.2 C36.1 C37.1 C38.1 C39.1 C40.1 C41.2 C42.1 C43.1 C44.1 R63.1 R64.1 R65.1 R66.1 R67.1 U3.11(TEST) U3.37(GND) X2.2(GND)
USB_DOWN_1_N: U3.1(USB_DOWN_1_M) ; port USB_DW_1_N
USB_DOWN_1_P: U3.2(USB_DOWN_1_P) ; port USB_DW_1_P
USB_DOWN_2_N: U3.3(USB_DOWN_2_M) ; port USB_DW_2_N
USB_DOWN_2_P: U3.4(USB_DOWN_2_P) ; port USB_DW_2_P
USB_DOWN_3_N: U3.6(USB_DOWN_3_M) ; port USB_DW_3_N
USB_DOWN_3_P: U3.7(USB_DOWN_3_P) ; port USB_DW_3_P
USB_ROOT_N: U3.30(USB_UP_M) ; port USB_ROOT_N
USB_ROOT_P: U3.31(USB_UP_P) ; port USB_ROOT_P
NetC32_2: C32.2 R61.1 TP3.1 U3.26(~{RESET}) ; port USB_RESET
NetC33_2: C33.2 U3.34(PLLFILTER)
NetC34_2: C34.2 U3.14(CRFILTER)
NetC40_2: C40.2 X2.1(EN) X2.4(VDD)
NetR62_1: R62.1 U3.27(VBUS_DET)
NetR63_2: R63.2 U3.28(NON_REM0_/_SUSP_IND)
NetR64_2: R64.2 U3.22(NON_REM1_/_SDA_/_SMDATA)
NetR65_2: R65.2 U3.24(CONFIG0_/_SCL_/_SMCLK)
NetR66_2: R66.2 U3.25(CONFIG1_/_HS_IND)
NetR67_2: R67.2 U3.35(RBIAS)
NetU3_33: U3.33(XTALIN) X2.3(OUT)

Not connected (* = marked no-connect by the designer): U3 12(PWR_EN_1)* 13(OSC_1)* 16(PWR_EN_2)* 17(OCS_2)* 18(PWR_EN_3)* 19(OCS_3)* 32(XTALOUT)*

### Layout directives
differential pair; differential pair class DIFF90: USB_DOWN_1_N, USB_DOWN_1_P, USB_DOWN_2_N, USB_DOWN_2_P, USB_DOWN_3_N, USB_DOWN_3_P
net class USB_DOWN1: USB_DOWN_1_N, USB_DOWN_1_P, USB_DOWN_2_N, USB_DOWN_2_P, USB_DOWN_3_N, USB_DOWN_3_P

### Notes on the sheet
- DESIGN NOTE
- USB HUB
- This USB hub is non-detatchable. The VBUS detect
- pin should therefore be connected to 3V3.
- The filter pins can have up to 100 nF low-ESR capacitors
- or be left unconnected.
- Title
- Size:
- A4
- Number:
- Revision:
- Date:
- File:
- Time:
- Sheet
- of

### Library data of the parts
C32-C34 C36-C40 C42-C44 = 04023C103KAT2A: C0402
C35 C41 = 02016D104KAT2A: C0603
R61-R67 = CRCW04020000Z0ED: R0402
U3 = USB2513B-I/M2: USB 2.0 Hub 3x ports; Supplier 1: Farnell; Supplier Part Number 1: 456
X2 = X1G0041710031 SG-210STF 24 MHZ L: Oscillator 3.2mm x 2.5mm

## Sheet [08] - AUDIO.SchDoc: AUDIO
size A4; Organization: Bjørn T. Brodtkorb; Address1: Frode Rinnans veg 161; Address2: 7050 Trondheim; DocumentNumber: 6598; Revision: 1.0; SheetNumber: 1; SheetTotal: 1
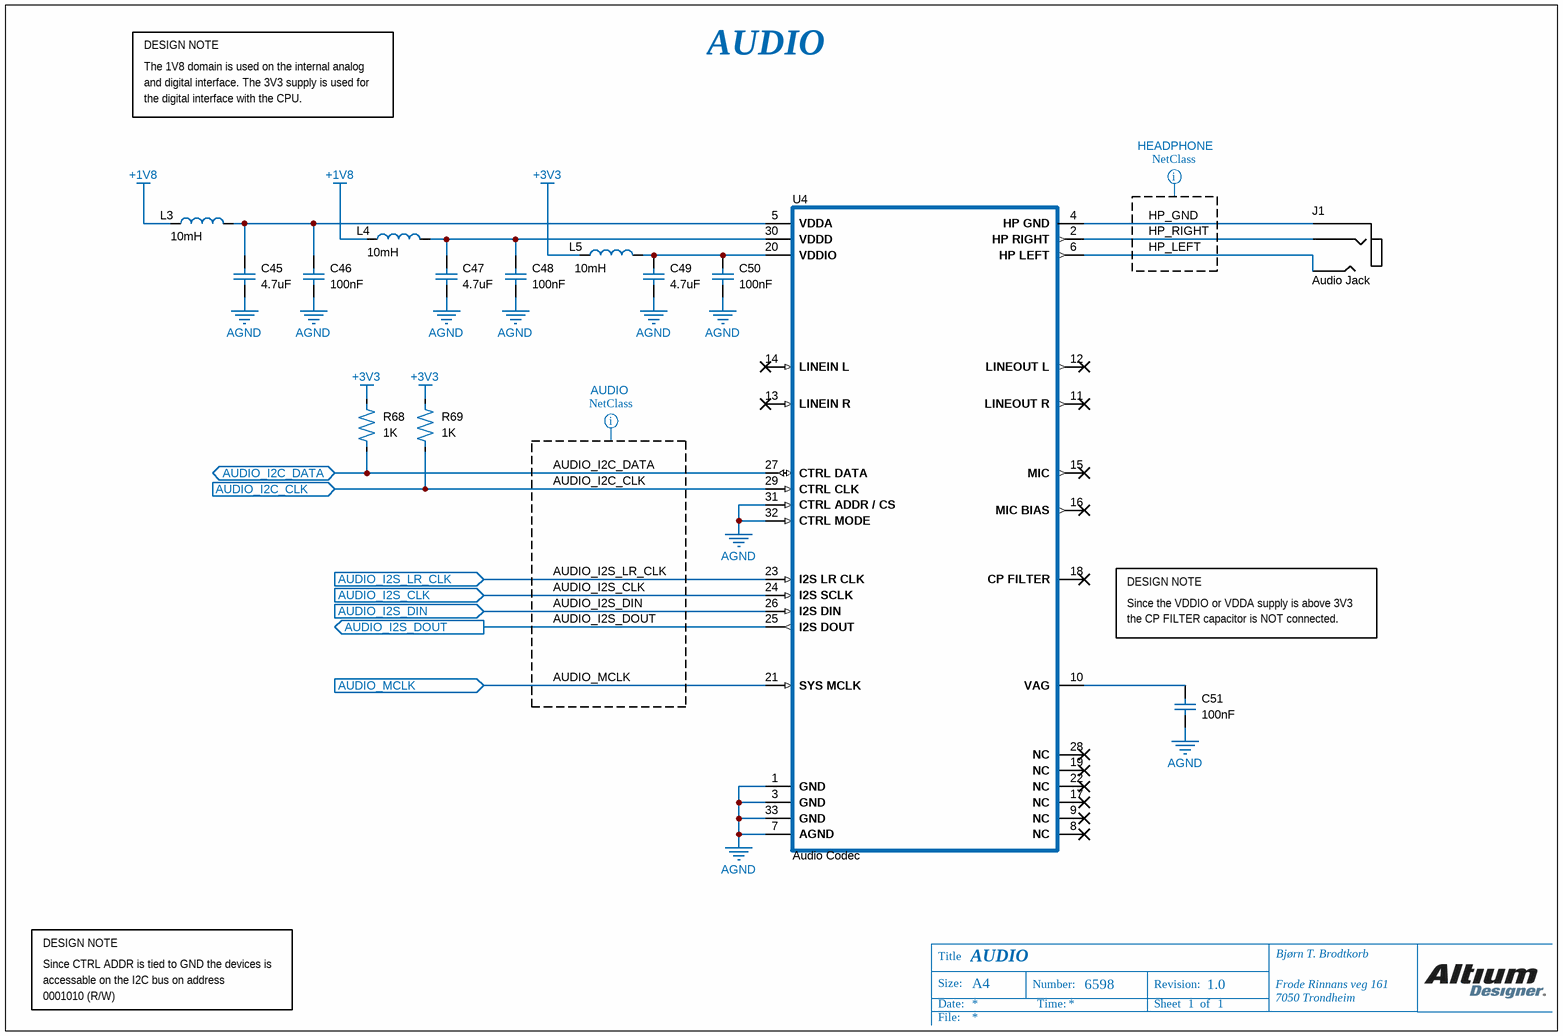
[diagram p8: [08] - AUDIO.SchDoc]

### Parts
C45  value 4.7uF  [C0603]  (hidden comment: 02016D104KAT2A)
C46  value 100nF  [C0402]  (hidden comment: 04023C103KAT2A)
C47  value 4.7uF  [C0603]  (hidden comment: 02016D104KAT2A)
C48  value 100nF  [C0402]  (hidden comment: 04023C103KAT2A)
C49  value 4.7uF  [C0603]  (hidden comment: 02016D104KAT2A)
C50  value 100nF  [C0402]  (hidden comment: 04023C103KAT2A)
C51  value 100nF  [C0402]  (hidden comment: 04023C103KAT2A)
J1  Audio Jack  [Audio jack barrel 3 contacts]
L3  value 10mH  [Inductor 0603]  (hidden comment: MLZ1608A2R2WT)
L4  value 10mH  [Inductor 0603]  (hidden comment: MLZ1608A2R2WT)
L5  value 10mH  [Inductor 0603]  (hidden comment: MLZ1608A2R2WT)
R68  value 1K  [R0402]  (hidden comment: CRCW04020000Z0ED)
R69  value 1K  [R0402]  (hidden comment: CRCW04020000Z0ED)
U4  Audio Codec  [SGTL5000XNAA3]

### Ports
AUDIO_I2C_CLK (in), AUDIO_I2C_DATA (bidir), AUDIO_I2S_CLK (in), AUDIO_I2S_DIN (in), AUDIO_I2S_DOUT (out), AUDIO_I2S_LR_CLK (in), AUDIO_MCLK (in)

### Nets
+1V8: L3.1 L4.1
+3V3: L5.1 R68.2 R69.2
AGND: C45.2 C46.2 C47.2 C48.2 C49.2 C50.2 C51.2 U4.1(GND) U4.3(GND) U4.7(AGND) U4.31(CTRL_ADDR_/_CS) U4.32(CTRL_MODE) U4.33(GND)
AUDIO_I2C_CLK: R69.1 U4.29(CTRL_CLK) ; port AUDIO_I2C_CLK
AUDIO_I2C_DATA: R68.1 U4.27(CTRL_DATA) ; port AUDIO_I2C_DATA
AUDIO_I2S_CLK: U4.24(I2S_SCLK) ; port AUDIO_I2S_CLK
AUDIO_I2S_DIN: U4.26(I2S_DIN) ; port AUDIO_I2S_DIN
AUDIO_I2S_DOUT: U4.25(I2S_DOUT) ; port AUDIO_I2S_DOUT
AUDIO_I2S_LR_CLK: U4.23(I2S_LR_CLK) ; port AUDIO_I2S_LR_CLK
AUDIO_MCLK: U4.21(SYS_MCLK) ; port AUDIO_MCLK
HP_GND: J1.1 U4.4(HP_GND)
HP_LEFT: J1.2 U4.6(HP_LEFT)
HP_RIGHT: J1.3 U4.2(HP_RIGHT)
NetC45_1: C45.1 C46.1 L3.2 U4.5(VDDA)
NetC47_1: C47.1 C48.1 L4.2 U4.30(VDDD)
NetC49_1: C49.1 C50.1 L5.2 U4.20(VDDIO)
NetC51_1: C51.1 U4.10(VAG)

Not connected (* = marked no-connect by the designer): U4 8(NC)* 9(NC)* 11(LINEOUT_R)* 12(LINEOUT_L)* 13(LINEIN_R)* 14(LINEIN_L)* 15(MIC)* 16(MIC_BIAS)* 17(NC)* 18(CP_FILTER)* 19(NC)* 22(NC)* 28(NC)*

### Layout directives
net class HEADPHONE: HP_GND, HP_LEFT, HP_RIGHT
net class AUDIO: AUDIO_I2C_CLK, AUDIO_I2C_DATA, AUDIO_I2S_CLK, AUDIO_I2S_DIN, AUDIO_I2S_DOUT, AUDIO_I2S_LR_CLK, AUDIO_MCLK

### Notes on the sheet
- DESIGN NOTE
- The 1V8 domain is used on the internal analog
- and digital interface. The 3V3 supply is used for
- the digital interface with the CPU.
- AUDIO
- Since the VDDIO or VDDA supply is above 3V3
- the CP FILTER capacitor is NOT connected.
- Since CTRL ADDR is tied to GND the devices is
- accessable on the I2C bus on address
- 0001010 (R/W)
- Title
- Size:
- A4
- Number:
- Revision:
- Date:
- File:
- Time:
- Sheet
- of

### Library data of the parts
C45 C47 C49 = 02016D104KAT2A: C0603
C46 C48 C50 C51 = 04023C103KAT2A: C0402
J1 = SJ-3524-SMT-TR: Audio jack barrel 3 contacts; Supplier Part Number 1: CP-3524SJCT-ND; Supplier 1: Digi-Key
L3-L5 = MLZ1608A2R2WT: Inductor 0603
R68 R69 = CRCW04020000Z0ED: R0402
U4 = SGTL5000XNAA3: Audio codec w/ headophone amp; ADC resolution: 24 bit; Sampling rate: 96 kSPS; Supplier 1: Farnell; Supplier Part Number 1: 2308049

## Sheet [09] - ETHERNET.SchDoc: ETHERNET
size A3; Organization: Bjørn T. Brodtkorb; Address1: Frode Rinnans veg 161; Address2: 7050 Trondheim; DocumentNumber: 6598; Revision: 1.0; SheetNumber: 1; SheetTotal: 1
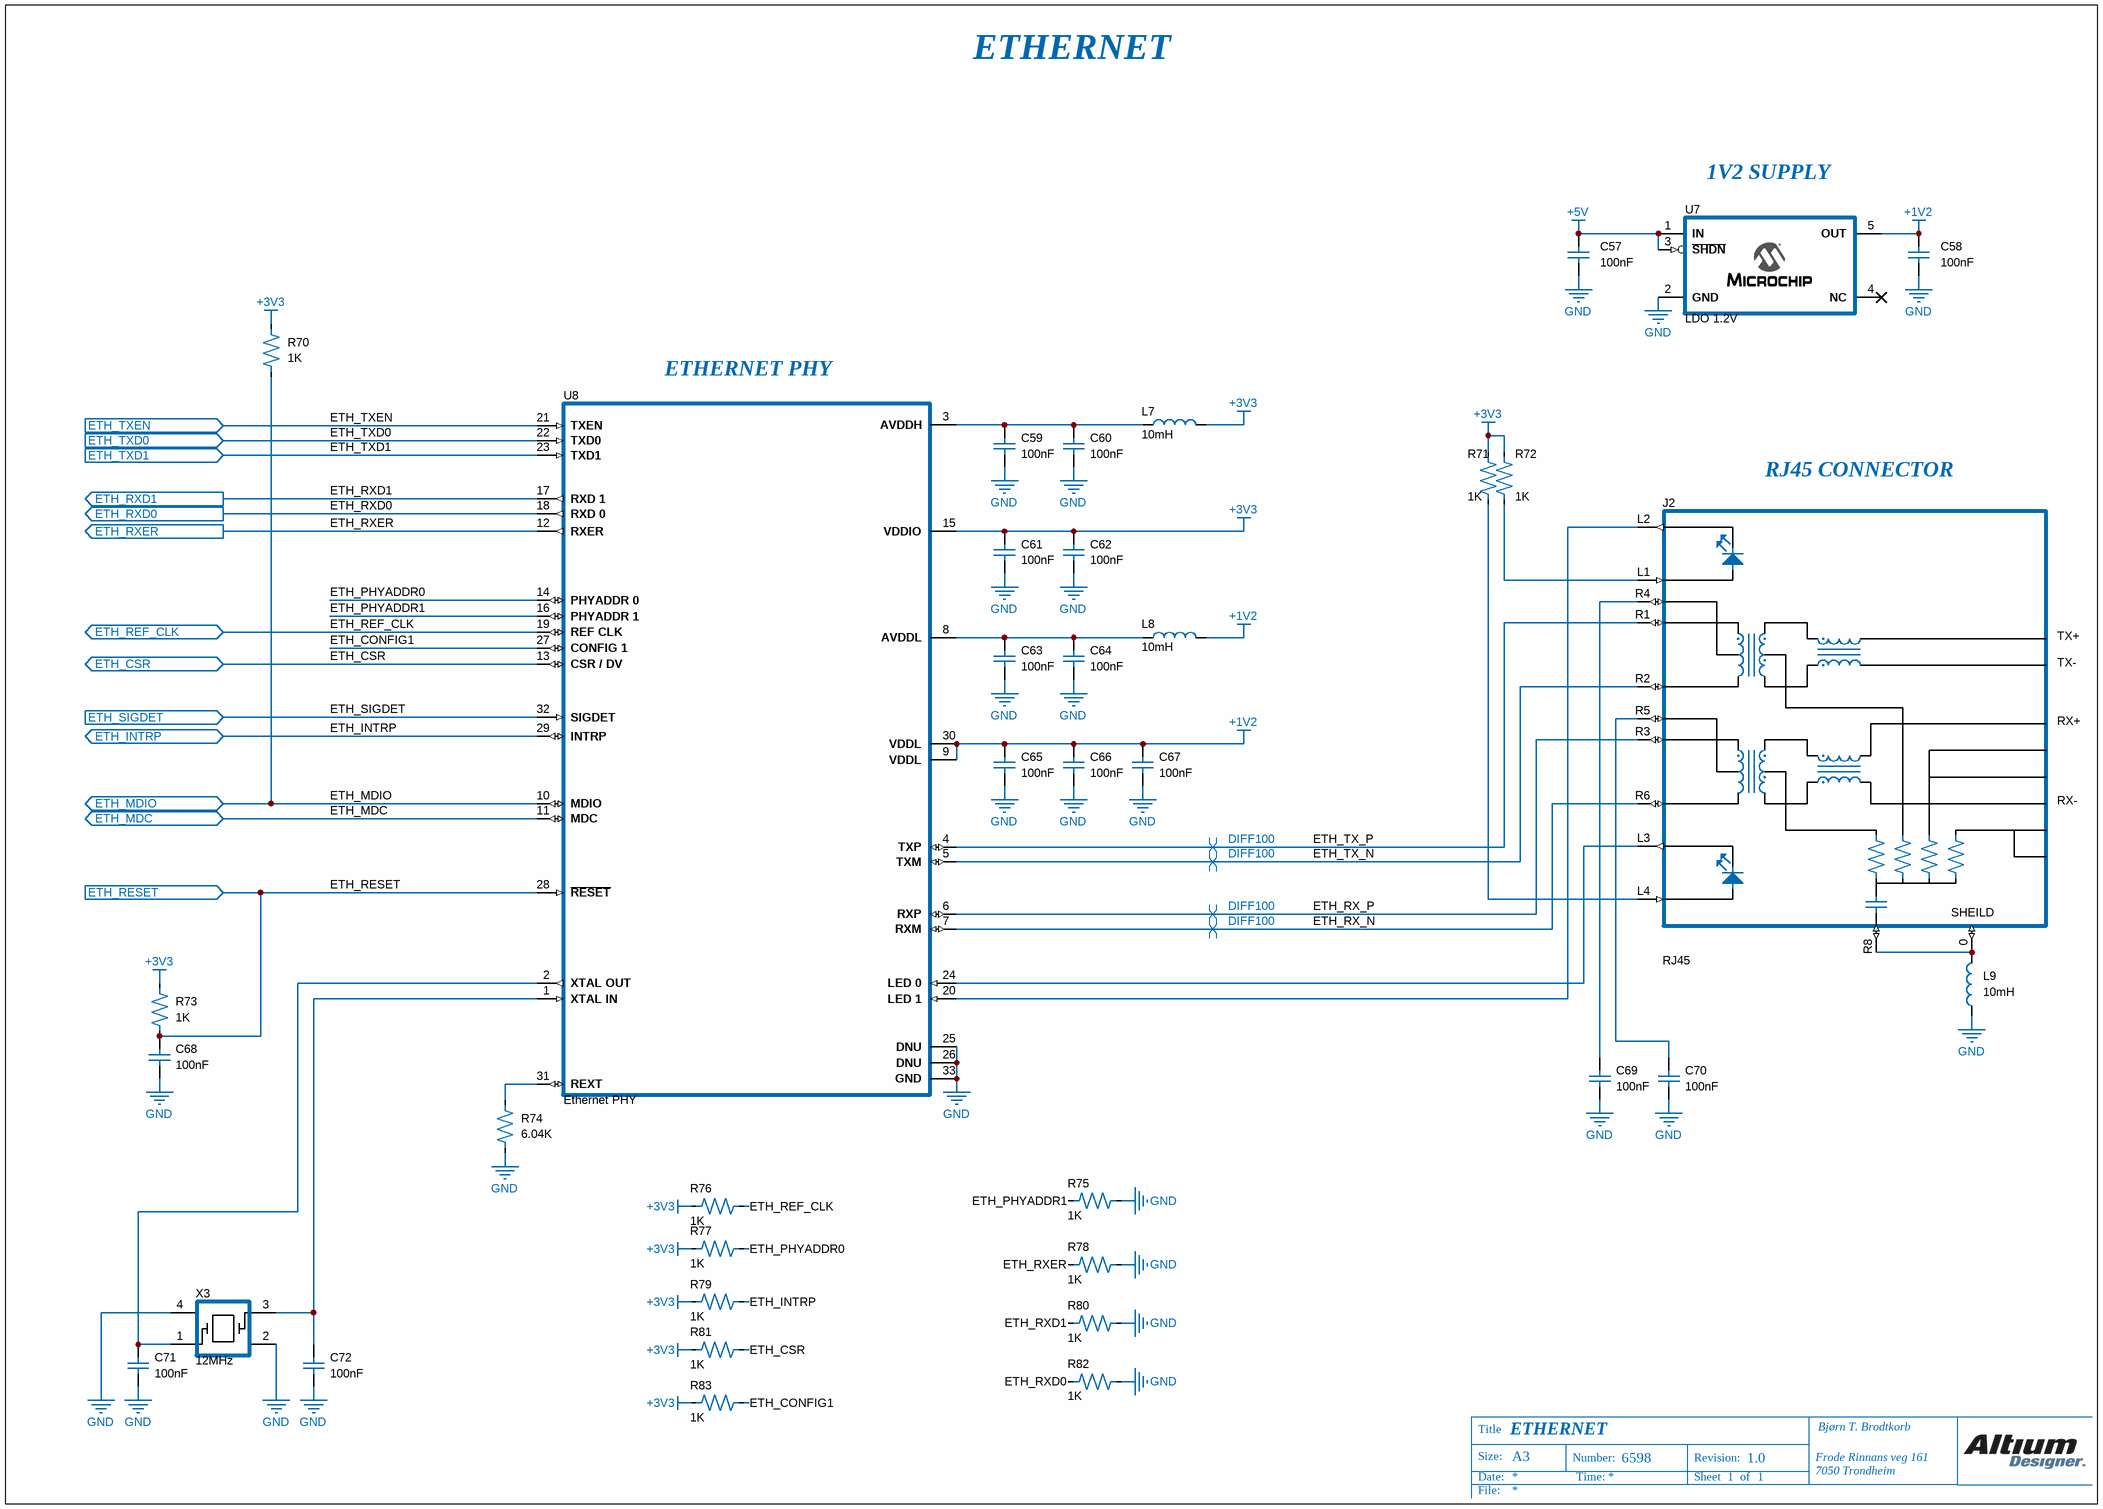
[diagram p9: [09] - ETHERNET.SchDoc]

### Parts
C57  value 100nF  [C0805]  (hidden comment: 08053C105KAT2A)
C58  value 100nF  [C0805]  (hidden comment: 08053C105KAT2A)
C59  value 100nF  [C0402]  (hidden comment: 04023C103KAT2A)
C60  value 100nF  [C0603]  (hidden comment: 02016D104KAT2A)
C61  value 100nF  [C0402]  (hidden comment: 04023C103KAT2A)
C62  value 100nF  [C0603]  (hidden comment: 02016D104KAT2A)
C63  value 100nF  [C0402]  (hidden comment: 04023C103KAT2A)
C64  value 100nF  [C0603]  (hidden comment: 02016D104KAT2A)
C65  value 100nF  [C0402]  (hidden comment: 04023C103KAT2A)
C66  value 100nF  [C0402]  (hidden comment: 04023C103KAT2A)
C67  value 100nF  [C0603]  (hidden comment: 02016D104KAT2A)
C68  value 100nF  [C0402]  (hidden comment: 04023C103KAT2A)
C69  value 100nF  [C0402]  (hidden comment: 04023C103KAT2A)
C70  value 100nF  [C0402]  (hidden comment: 04023C103KAT2A)
C71  value 100nF  [C0402]  (hidden comment: 04023C103KAT2A)
C72  value 100nF  [C0402]  (hidden comment: 04023C103KAT2A)
J2  RJ45  [RJ45 8P8C LED & magnetics]
L7  value 10mH  [Inductor 0603]  (hidden comment: MLZ1608A2R2WT)
L8  value 10mH  [Inductor 0603]  (hidden comment: MLZ1608A2R2WT)
L9  value 10mH  [Inductor 0603]  (hidden comment: MLZ1608A2R2WT)
R70  value 1K  [R0402]  (hidden comment: CRCW04020000Z0ED)
R71  value 1K  [R0402]  (hidden comment: CRCW04020000Z0ED)
R72  value 1K  [R0402]  (hidden comment: CRCW04020000Z0ED)
R73  value 1K  [R0402]  (hidden comment: CRCW04020000Z0ED)
R74  value 6.04K  [R0402]  (hidden comment: CRCW04020000Z0ED)
R75  value 1K  [R0402]  (hidden comment: CRCW04020000Z0ED)
R76  value 1K  [R0402]  (hidden comment: CRCW04020000Z0ED)
R77  value 1K  [R0402]  (hidden comment: CRCW04020000Z0ED)
R78  value 1K  [R0402]  (hidden comment: CRCW04020000Z0ED)
R79  value 1K  [R0402]  (hidden comment: CRCW04020000Z0ED)
R80  value 1K  [R0402]  (hidden comment: CRCW04020000Z0ED)
R81  value 1K  [R0402]  (hidden comment: CRCW04020000Z0ED)
R82  value 1K  [R0402]  (hidden comment: CRCW04020000Z0ED)
R83  value 1K  [R0402]  (hidden comment: CRCW04020000Z0ED)
U7  LDO 1.2V  [MCP1801T-1202I/OT]
U8  Ethernet PHY  [KSZ8061RNBW]
X3  12MHz  [MCSJK-7U-12.00-12-30-80-B-30]

### Ports
ETH_CSR (bidir), ETH_INTRP (bidir), ETH_MDC (bidir), ETH_MDIO (bidir), ETH_REF_CLK (bidir), ETH_RESET (in), ETH_RXD0 (out), ETH_RXD1 (out), ETH_RXER (out), ETH_SIGDET (in), ETH_TXD0 (in), ETH_TXD1 (in), ETH_TXEN (in)

### Nets
+1V2: C58.2 C65.2 C66.2 C67.1 L8.2 U7.5(OUT) U8.9(VDDL) U8.30(VDDL)
+3V3: C61.2 C62.1 L7.2 R70.1 R71.1 R72.1 R73.1 R76.1 R77.1 R79.1 R81.1 R83.1 U8.15(VDDIO)
+5V: C57.2 U7.1(IN) U7.3(~{SHDN})
GND: C57.1 C58.1 C59.1 C60.2 C61.1 C62.2 C63.1 C64.2 C65.1 C66.1 C67.2 C68.1 C69.1 C70.1 C71.1 C72.1 L9.1 R74.2 R75.2 R78.2 R80.2 R82.2 U7.2(GND) U8.25(DNU) U8.26(DNU) U8.33(GND) X3.2 X3.4
ETH_CONFIG1: R83.2 U8.27(CONFIG_1)
ETH_CSR: R81.2 U8.13(CSR_/_DV) ; port ETH_CSR
ETH_INTRP: R79.2 U8.29(INTRP) ; port ETH_INTRP
ETH_MDC: U8.11(MDC) ; port ETH_MDC
ETH_MDIO: R70.2 U8.10(MDIO) ; port ETH_MDIO
ETH_PHYADDR0: R77.2 U8.14(PHYADDR_0)
ETH_PHYADDR1: R75.1 U8.16(PHYADDR_1)
ETH_REF_CLK: R76.2 U8.19(REF_CLK) ; port ETH_REF_CLK
ETH_RESET: C68.2 R73.2 U8.28(~{RESET}) ; port ETH_RESET
ETH_RX_N: J2.R6 U8.7(RXM)
ETH_RX_P: J2.R3 U8.6(RXP)
ETH_RXD0: R82.1 U8.18(RXD_0) ; port ETH_RXD0
ETH_RXD1: R80.1 U8.17(RXD_1) ; port ETH_RXD1
ETH_RXER: R78.1 U8.12(RXER) ; port ETH_RXER
ETH_SIGDET: U8.32(SIGDET) ; port ETH_SIGDET
ETH_TX_N: J2.R2 U8.5(TXM)
ETH_TX_P: J2.R1 U8.4(TXP)
ETH_TXD0: U8.22(TXD0) ; port ETH_TXD0
ETH_TXD1: U8.23(TXD1) ; port ETH_TXD1
ETH_TXEN: U8.21(TXEN) ; port ETH_TXEN
NetC59_2: C59.2 C60.1 L7.1 U8.3(AVDDH)
NetC63_2: C63.2 C64.1 L8.1 U8.8(AVDDL)
NetC69_2: C69.2 J2.R4
NetC70_2: C70.2 J2.R5
NetC71_2: C71.2 U8.2(XTAL_OUT) X3.1
NetC72_2: C72.2 U8.1(XTAL_IN) X3.3
NetJ2_0: J2.0 J2.R8 L9.2
NetJ2_L1: J2.L1 R72.2
NetJ2_L2: J2.L2 U8.20(LED_1)
NetJ2_L3: J2.L3 U8.24(LED_0)
NetJ2_L4: J2.L4 R71.2
NetR74_1: R74.1 U8.31(REXT)

Not connected (* = marked no-connect by the designer): J2 1 2; U7 4(NC)*

### Layout directives
differential pair; differential pair class DIFF100: ETH_RX_N, ETH_RX_P, ETH_TX_N, ETH_TX_P

### Notes on the sheet
- ETHERNET
- (near U7) 1V2 SUPPLY
- (near U8) ETHERNET PHY
- (near J2) RJ45 CONNECTOR
- Title
- Size:
- A3
- Number:
- Revision:
- Date:
- File:
- Time:
- Sheet
- of
- (in symbol 234235-2-2-1-12) TX+; TX-; RX+; RX-; SHEILD

### Library data of the parts
C57 C58 = 08053C105KAT2A: C0805
C59 C61 C63 C65 C66 C68-C72 = 04023C103KAT2A: C0402
C60 C62 C64 C67 = 02016D104KAT2A: C0603
J2 = 234235-2-2-1-12: RJ45 8P8C LED & magnetics; Supplier 1: Digi-Key; Supplier Part Number 1: RJMG1BD3B8K1ANR-ND
L7-L9 = MLZ1608A2R2WT: Inductor 0603
R70-R83 = CRCW04020000Z0ED: R0402
U7 = MCP1801T-1202I/OT: LDO fixed 1.2V 150mA; Dropout voltage: 1.03V; Supplier 1: Farnell; Supplier Part Number 1: 1851980; Output current: 150mA; Output voltage: 1.2V
U8 = KSZ8061RNBW: Ethernet PHY 10BASE-T / 100BASE-T; Supplier 1: Digi-Key; Supplier Part Number 1: KSZ8061RNBW-CT-ND
X3 = MCSJK-7U-12.00-12-30-80-B-30: Crystal 12MHz 3.2mm x 2.5mm; Supplier Part Number 1: 2853917; Supplier 1: Farnell

## Sheet [10] - FTDI.SchDoc: FTDI
size A3; Organization: Bjørn T. Brodtkorb; Address1: Frode Rinnans veg 161; Address2: 7050 Trondheim; DocumentNumber: 6598; Revision: 1.0; SheetNumber: 1; SheetTotal: 1
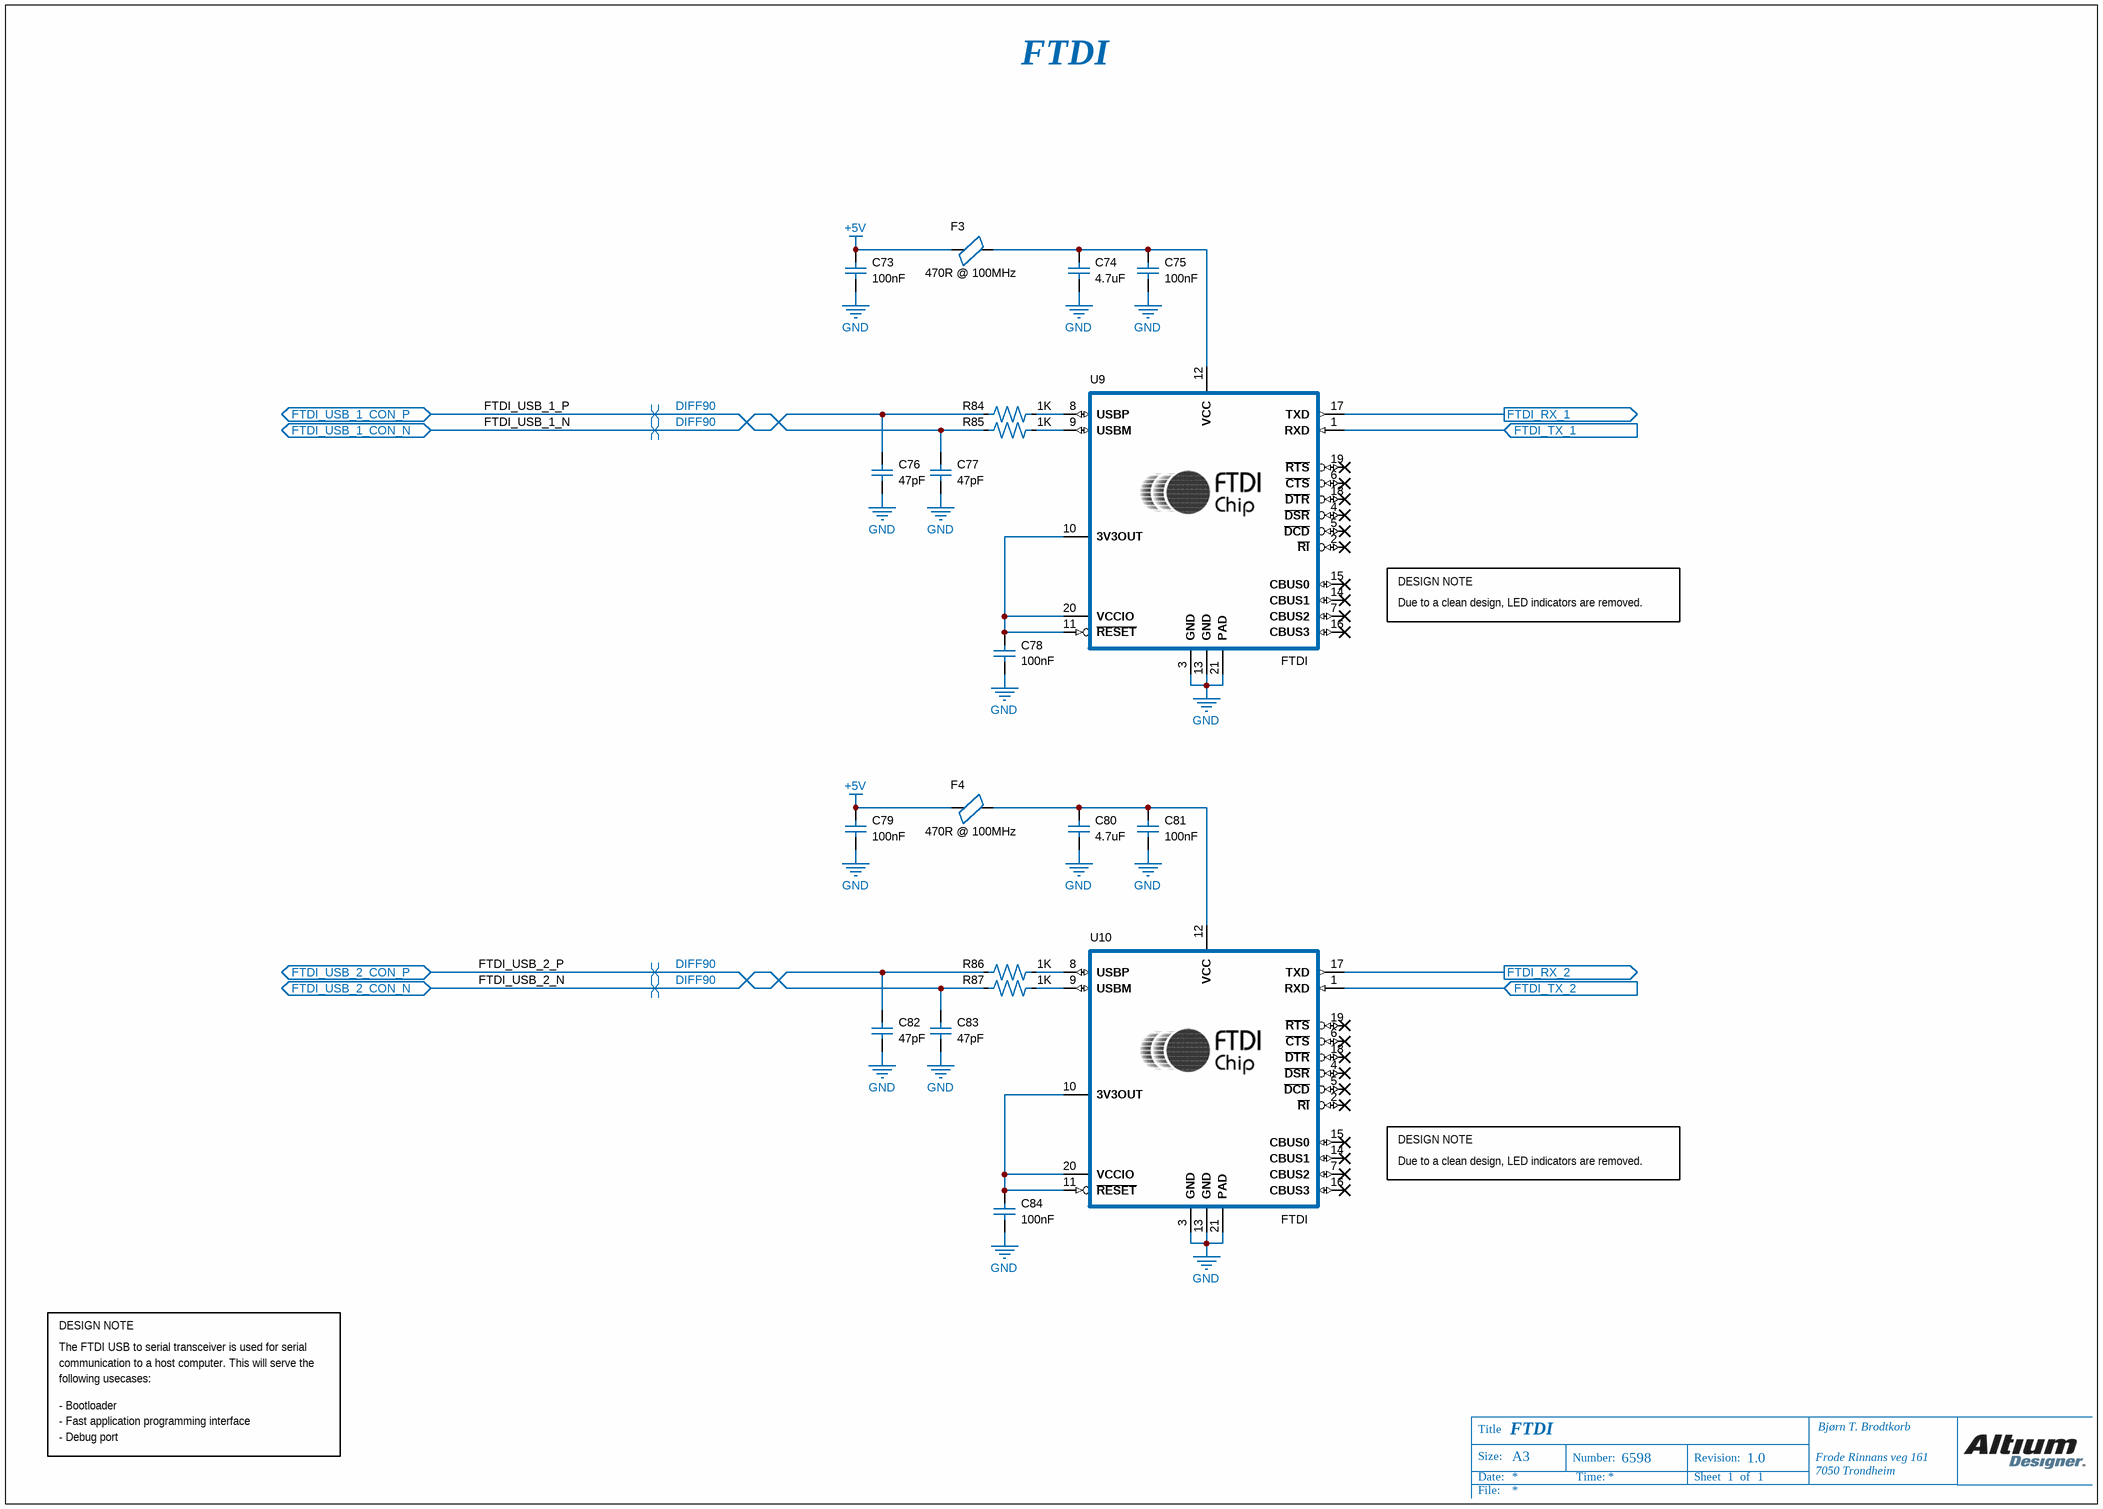
[diagram p10: [10] - FTDI.SchDoc]

### Parts
C73  value 100nF  [C0402]  (hidden comment: 04023C103KAT2A)
C74  value 4.7uF  [C0603]  (hidden comment: 02016D104KAT2A)
C75  value 100nF  [C0402]  (hidden comment: 04023C103KAT2A)
C76  value 47pF  [C0402]  (hidden comment: 04023C103KAT2A)
C77  value 47pF  [C0402]  (hidden comment: 04023C103KAT2A)
C78  value 100nF  [C0402]  (hidden comment: 04023C103KAT2A)
C79  value 100nF  [C0402]  (hidden comment: 04023C103KAT2A)
C80  value 4.7uF  [C0603]  (hidden comment: 02016D104KAT2A)
C81  value 100nF  [C0402]  (hidden comment: 04023C103KAT2A)
C82  value 47pF  [C0402]  (hidden comment: 04023C103KAT2A)
C83  value 47pF  [C0402]  (hidden comment: 04023C103KAT2A)
C84  value 100nF  [C0402]  (hidden comment: 04023C103KAT2A)
F3  value 470R @ 100MHz  [Ferrite bead 0402]  (hidden comment: BLM15AG102SN1D)
F4  value 470R @ 100MHz  [Ferrite bead 0402]  (hidden comment: BLM15AG102SN1D)
R84  value 1K  [R0402]  (hidden comment: CRCW04020000Z0ED)
R85  value 1K  [R0402]  (hidden comment: CRCW04020000Z0ED)
R86  value 1K  [R0402]  (hidden comment: CRCW04020000Z0ED)
R87  value 1K  [R0402]  (hidden comment: CRCW04020000Z0ED)
U9  FTDI  [FT231XQ-R]
U10  FTDI  [FT231XQ-R]

### Ports
FTDI_RX_1 (out), FTDI_RX_2 (out), FTDI_TX_1 (in), FTDI_TX_2 (in), FTDI_USB_1_CON_N (bidir), FTDI_USB_1_CON_P (bidir), FTDI_USB_2_CON_N (bidir), FTDI_USB_2_CON_P (bidir)

### Nets
+5V: C73.1 C79.1 F3.1 F4.1
GND: C73.2 C74.2 C75.2 C76.2 C77.2 C78.2 C79.2 C80.2 C81.2 C82.2 C83.2 C84.2 U9.3(GND) U9.13(GND) U9.21(PAD) U10.3(GND) U10.13(GND) U10.21(PAD)
FTDI_USB_1_N: C77.1 R85.1 ; port FTDI_USB_1_CON_N
FTDI_USB_1_P: C76.1 R84.1 ; port FTDI_USB_1_CON_P
FTDI_USB_2_N: C83.1 R87.1 ; port FTDI_USB_2_CON_N
FTDI_USB_2_P: C82.1 R86.1 ; port FTDI_USB_2_CON_P
NetC74_1: C74.1 C75.1 F3.2 U9.12(VCC)
NetC78_1: C78.1 U9.10(3V3OUT) U9.11(~{RESET}) U9.20(VCCIO)
NetC80_1: C80.1 C81.1 F4.2 U10.12(VCC)
NetC84_1: C84.1 U10.10(3V3OUT) U10.11(~{RESET}) U10.20(VCCIO)
NetR84_2: R84.2 U9.8(USBP)
NetR85_2: R85.2 U9.9(USBM)
NetR86_2: R86.2 U10.8(USBP)
NetR87_2: R87.2 U10.9(USBM)
NetU9_1: U9.1(RXD) ; port FTDI_TX_1
NetU9_17: U9.17(TXD) ; port FTDI_RX_1
NetU10_1: U10.1(RXD) ; port FTDI_TX_2
NetU10_17: U10.17(TXD) ; port FTDI_RX_2

Not connected (* = marked no-connect by the designer): U9 2(~{RI})* 4(~{DSR})* 5(~{DCD})* 6(~{CTS})* 7(CBUS2)* 14(CBUS1)* 15(CBUS0)* 16(CBUS3)* 18(~{DTR})* 19(~{RTS})*; U10 2(~{RI})* 4(~{DSR})* 5(~{DCD})* 6(~{CTS})* 7(CBUS2)* 14(CBUS1)* 15(CBUS0)* 16(CBUS3)* 18(~{DTR})* 19(~{RTS})*

### Layout directives
differential pair; differential pair class DIFF90: FTDI_USB_1_N, FTDI_USB_1_P, FTDI_USB_2_N, FTDI_USB_2_P

### Notes on the sheet
- FTDI
- DESIGN NOTE
- Due to a clean design, LED indicators are removed.
- The FTDI USB to serial transceiver is used for serial
- communication to a host computer. This will serve the
- following usecases:
- - Bootloader
- - Fast application programming interface
- - Debug port
- Title
- Size:
- A3
- Number:
- Revision:
- Date:
- File:
- Time:
- Sheet
- of

### Library data of the parts
C73 C75-C79 C81-C84 = 04023C103KAT2A: C0402
C74 C80 = 02016D104KAT2A: C0603
F3 F4 = BLM15AG102SN1D: Ferrite bead 0402
R84-R87 = CRCW04020000Z0ED: R0402
U9 U10 = FT231XQ-R: USB to RS-232 converter; Supplier Part Number 1: 2081330; Supplier 1: Farnell

## Sheet [11] - IO.SchDoc: IO
size A4; Organization: Bjørn T. Brodtkorb; Address1: Frode Rinnans veg 161; Address2: 7050 Trondheim; DocumentNumber: 6598; Revision: 1.0; SheetNumber: 1; SheetTotal: 1
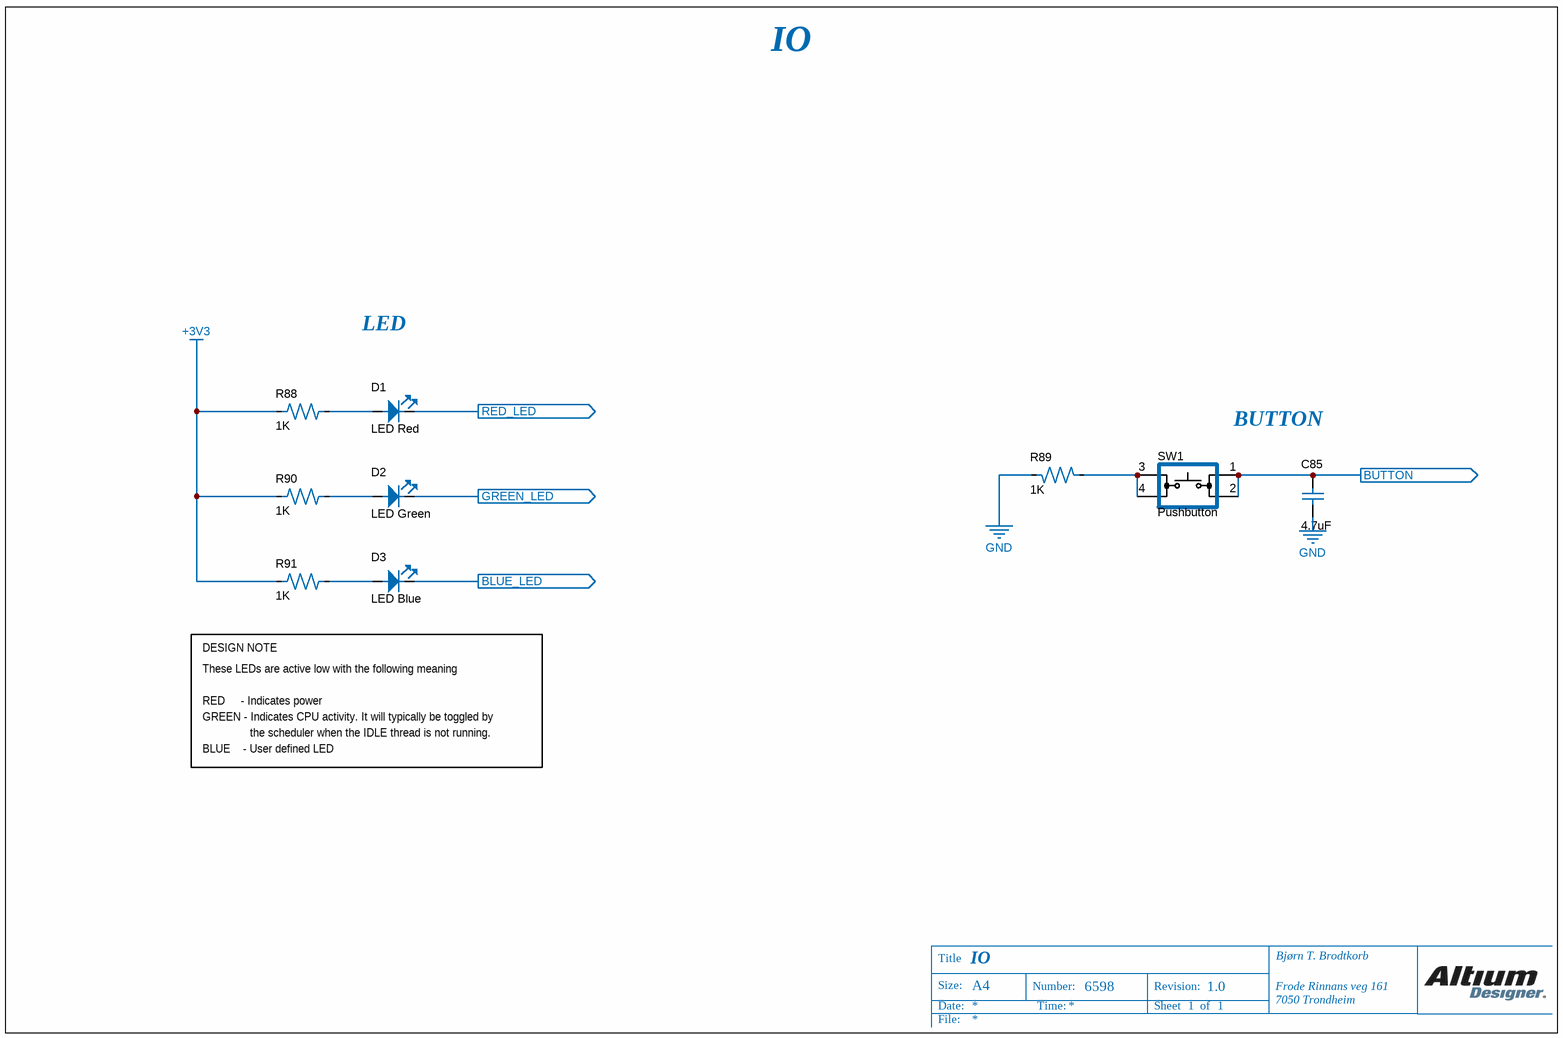
[diagram p11: [11] - IO.SchDoc]

### Parts
C85  value 4.7uF  [C0603]  (hidden comment: 02016D104KAT2A)
D1  LED Red  [L0603 RED]
D2  LED Green  [L0603 GREEN]
D3  LED Blue  [L0603 BLUE]
R88  value 1K  [R0402]  (hidden comment: CRCW04020000Z0ED)
R89  value 1K  [R0603]  (hidden comment: CPF-A-0603B100KE1)
R90  value 1K  [R0402]  (hidden comment: CRCW04020000Z0ED)
R91  value 1K  [R0402]  (hidden comment: CRCW04020000Z0ED)
SW1  Pushbutton  [KSC222G LFS]

### Ports
BLUE_LED (out), BUTTON (out), GREEN_LED (out), RED_LED (out)

### Nets
+3V3: R88.1 R90.1 R91.1
GND: C85.1 R89.2
NetC85_2: C85.2 SW1.1 SW1.2 ; port BUTTON
NetD1_1: D1.1 R88.2
NetD1_2: D1.2 ; port RED_LED
NetD2_1: D2.1 R90.2
NetD2_2: D2.2 ; port GREEN_LED
NetD3_1: D3.1 R91.2
NetD3_2: D3.2 ; port BLUE_LED
NetR89_1: R89.1 SW1.3 SW1.4

### Notes on the sheet
- IO
- LED
- (near SW1) BUTTON
- DESIGN NOTE
- These LEDs are active low with the following meaning
- RED     - Indicates power
- GREEN - Indicates CPU activity. It will typically be toggled by
- BLUE    - User defined LED
- the scheduler when the IDLE thread is not running.
- Title
- Size:
- A4
- Number:
- Revision:
- Date:
- File:
- Time:
- Sheet
- of

### Library data of the parts
C85 = 02016D104KAT2A: C0603
D1 = HSMG-C190: LED 0603 Red
D2 = HSMG-C196: LED 0603 Green
D3 = HSMG-C199: LED 0603 Blue
R88 R90 R91 = CRCW04020000Z0ED: R0402
R89 = CPF-A-0603B100KE1: R0603
SW1 = KSC222G LFS: Pushbutton SMD; Supplier Part Number 1: 2845714; Supplier 1: Farnell

## Sheet [12] - POWER.SchDoc: POWER
size A4; Organization: Bjørn T. Brodtkorb; Address1: Frode Rinnans veg 161; Address2: 7050 Trondheim; DocumentNumber: 6598; Revision: 1.0; SheetNumber: 1; SheetTotal: 1
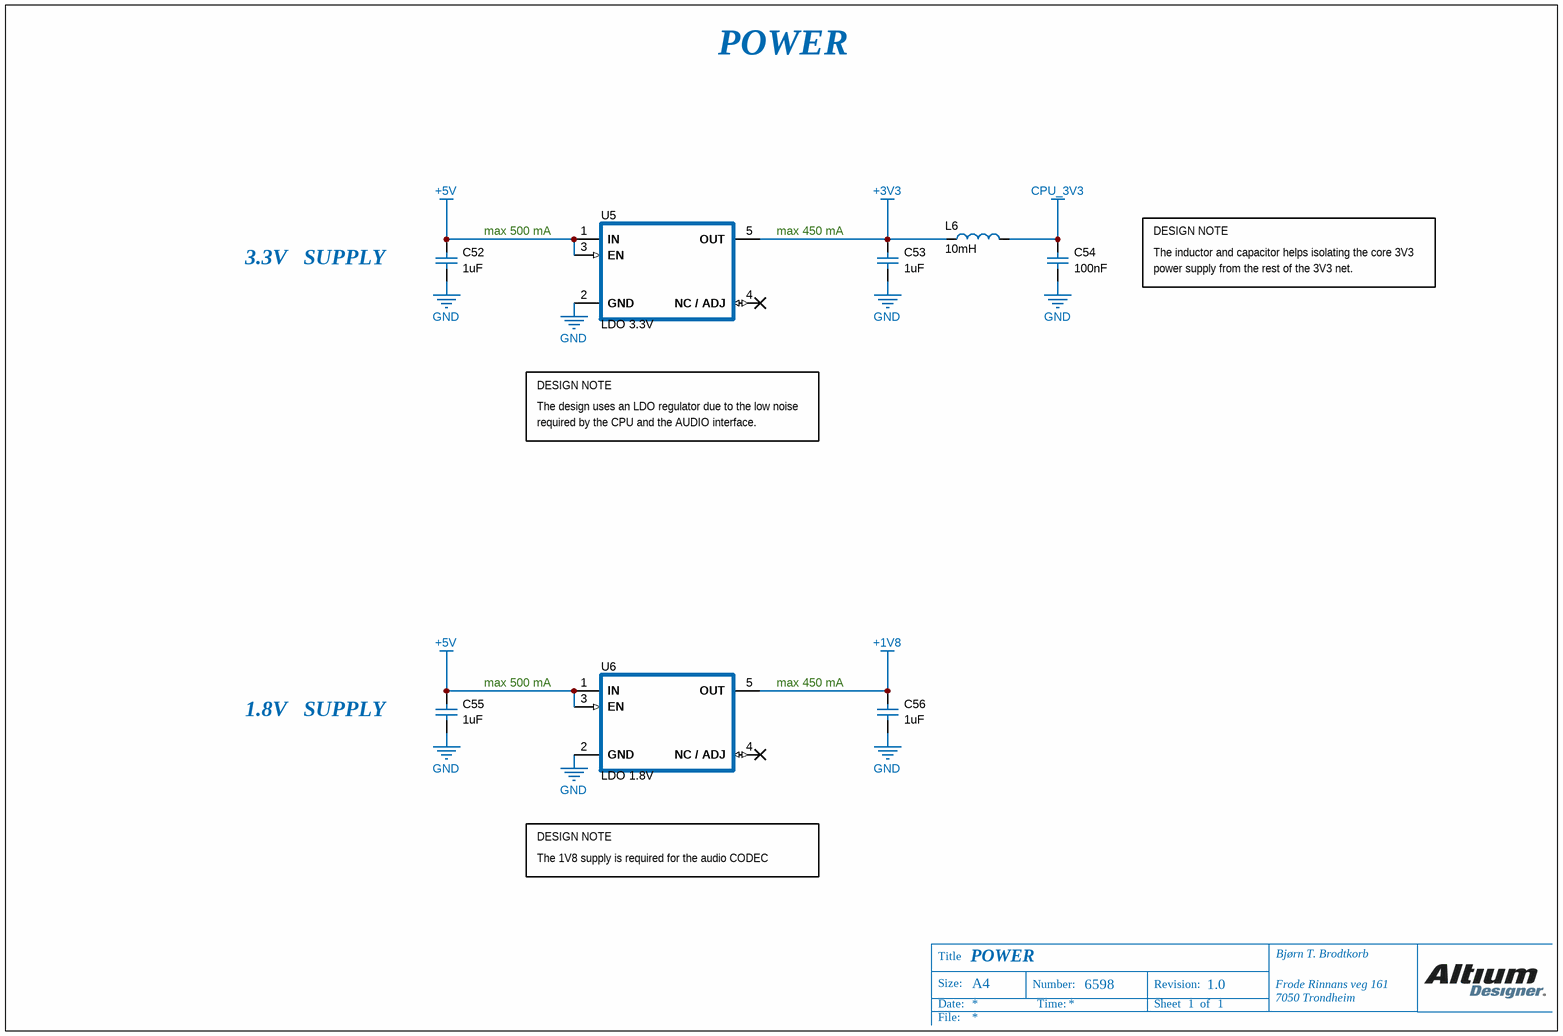
[diagram p12: [12] - POWER.SchDoc]

### Parts
C52  value 1uF  [C0805]  (hidden comment: 08053C105KAT2A)
C53  value 1uF  [C0805]  (hidden comment: 08053C105KAT2A)
C54  value 100nF  [C0603]  (hidden comment: 02016D104KAT2A)
C55  value 1uF  [C0805]  (hidden comment: 08053C105KAT2A)
C56  value 1uF  [C0805]  (hidden comment: 08053C105KAT2A)
L6  value 10mH  [Inductor 0603]  (hidden comment: MLZ1608A2R2WT)
U5  LDO 3.3V  [NCV8161BSN330T1G]
U6  LDO 1.8V  [SOT95P275X110-5N]

### Nets
+1V8: C56.2 U6.5(OUT)
+3V3: C53.2 L6.1 U5.5(OUT)
+5V: C52.2 C55.2 U5.1(IN) U5.3(EN) U6.1(IN) U6.3(EN)
CPU_3V3: C54.2 L6.2
GND: C52.1 C53.1 C54.1 C55.1 C56.1 U5.2(GND) U6.2(GND)

Not connected (* = marked no-connect by the designer): U5 4(NC_/_ADJ)*; U6 4(NC_/_ADJ)*

### Notes on the sheet
- POWER
- max 500 mA
- max 450 mA
- DESIGN NOTE
- 3.3V   SUPPLY
- The inductor and capacitor helps isolating the core 3V3
- power supply from the rest of the 3V3 net.
- The design uses an LDO regulator due to the low noise
- required by the CPU and the AUDIO interface.
- 1.8V   SUPPLY
- The 1V8 supply is required for the audio CODEC
- Title
- Size:
- A4
- Number:
- Revision:
- Date:
- File:
- Time:
- Sheet
- of

### Library data of the parts
C52 C53 C55 C56 = 08053C105KAT2A: C0805
C54 = 02016D104KAT2A: C0603
L6 = MLZ1608A2R2WT: Inductor 0603
U5 = NCV8161BSN330T1G: LDO fixed 3.3V 450mA ultra-low noise; RMS noise: < 100 uVrms; Dropout voltage: 330mV; Supplier Part Number 1: 2775470; Supplier 1: Farnell; Output voltage: 3.3V; Output current: 450mA
U6 = NCV8161ASN180T1G: LDO fixed 1.8V 450mA ultra-low noise; Dropout voltage: 200mV; Supplier 1: Farnell; Output voltage: 1.8V; Supplier Part Number 1: 2775471; Output current: 450mA

## Sheet [13] - CONNECTORS.SchDoc: CONNECTORS
size A3; Organization: Bjørn T. Brodtkorb; Address1: Frode Rinnans veg 161; Address2: 7050 Trondheim; DocumentNumber: 6598; Revision: 1.0; SheetNumber: 1; SheetTotal: 1
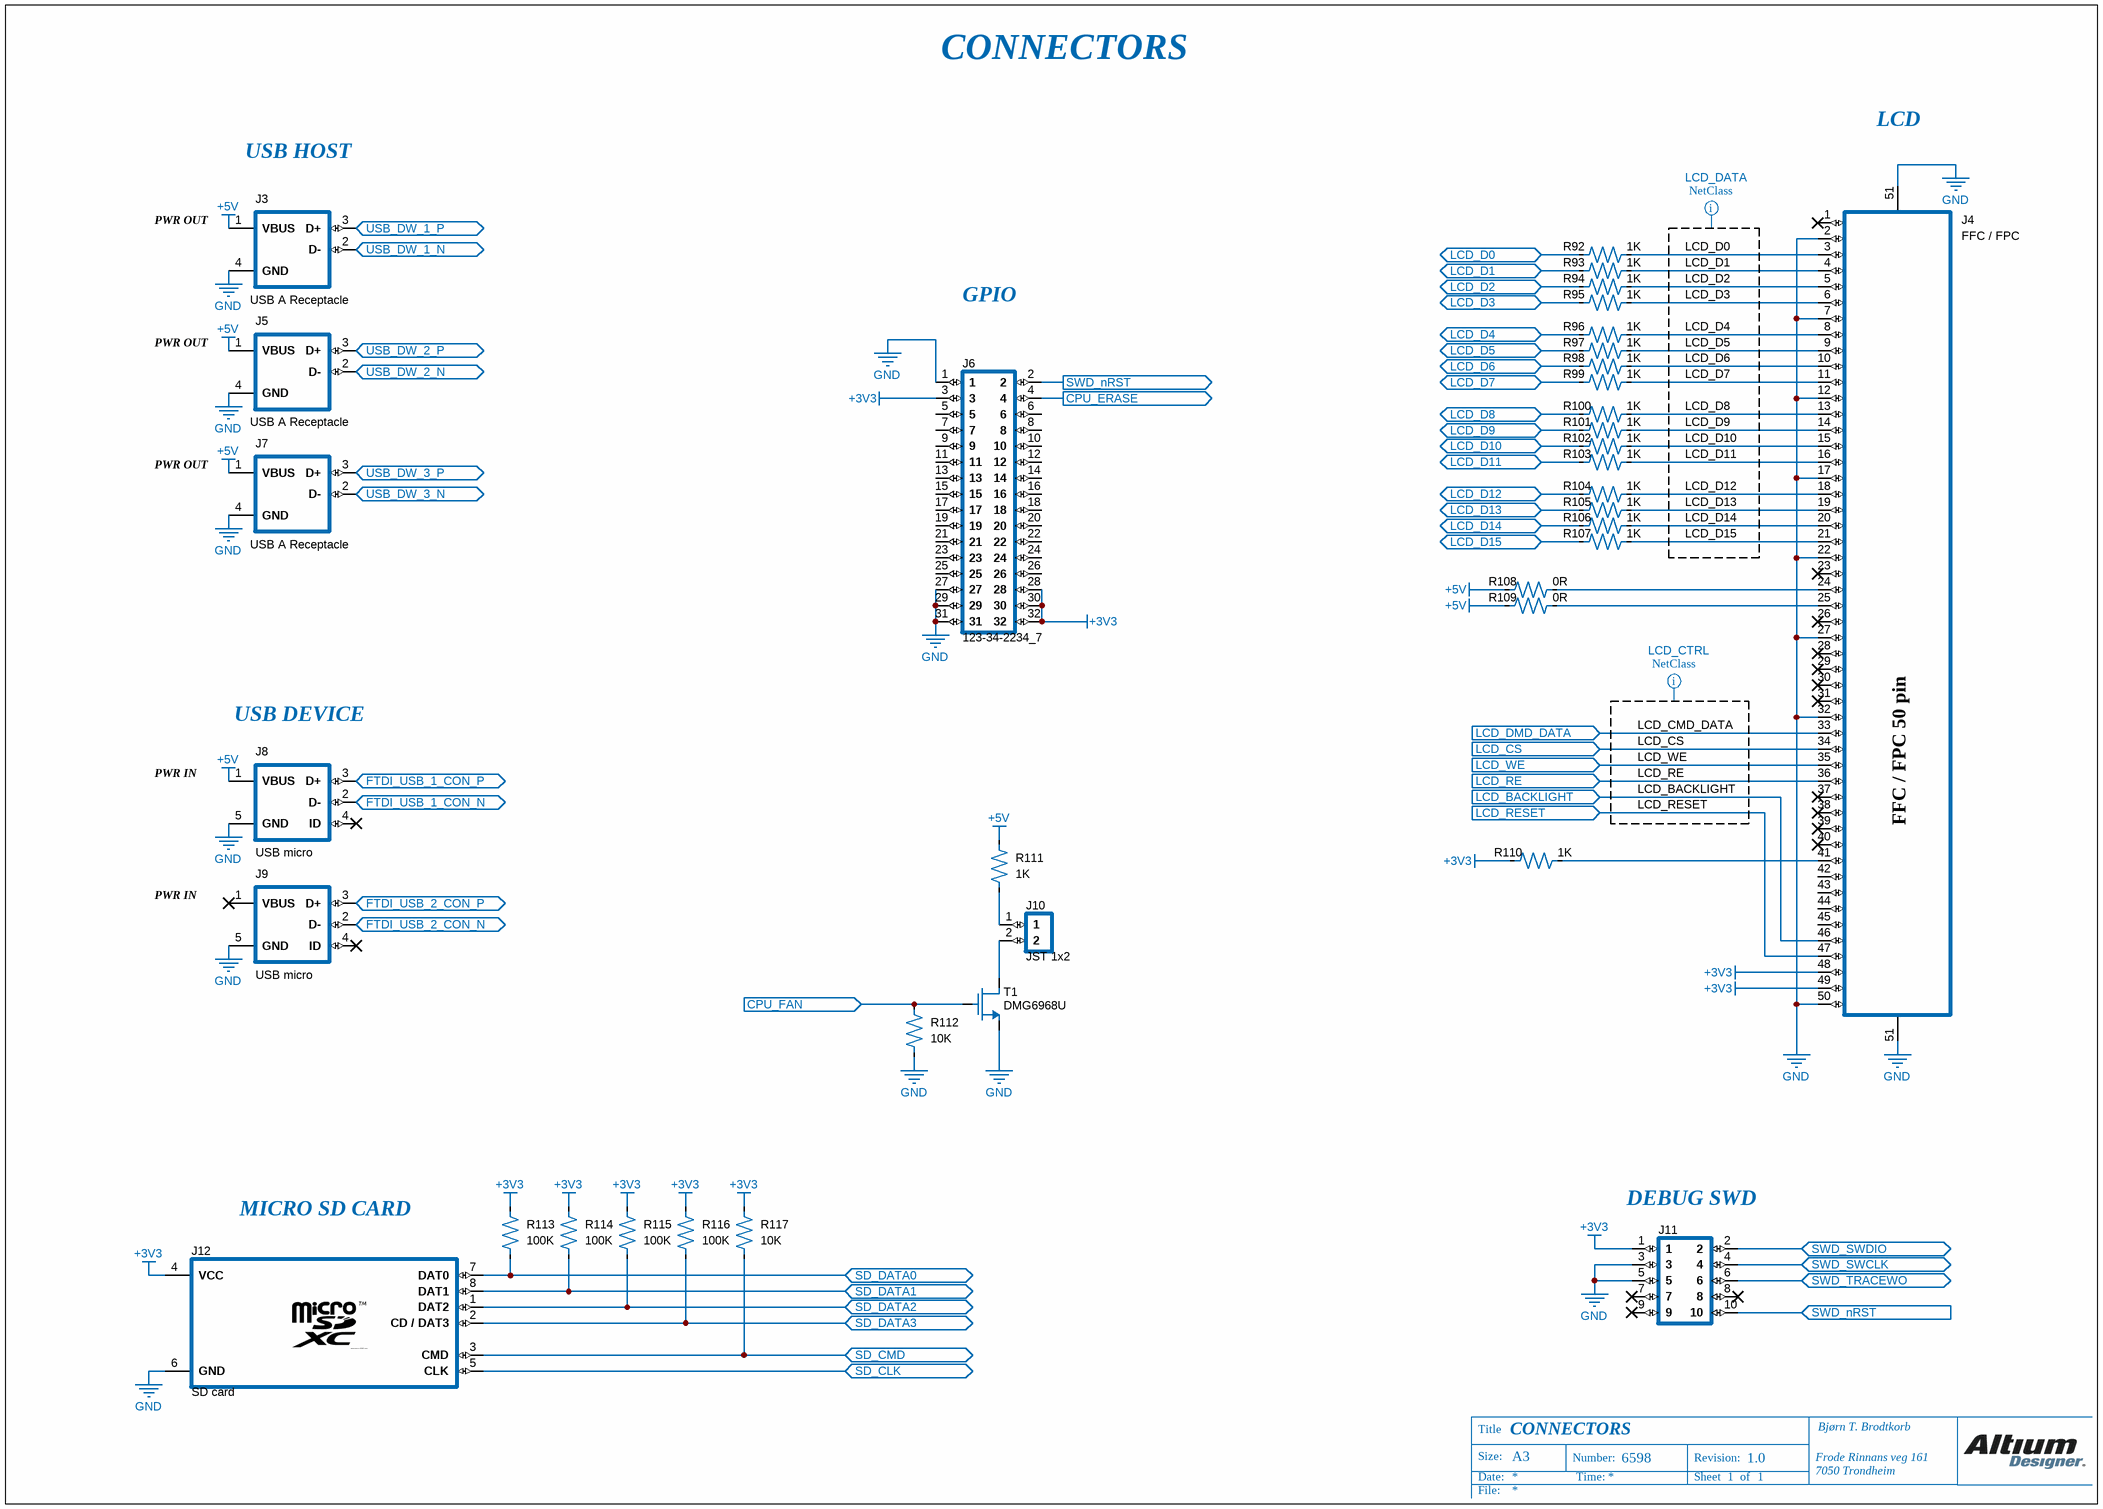
[diagram p13: [13] - CONNECTORS.SchDoc]

### Parts
J3  USB A Receptacle  [USB A Socket]
J4  FFC / FPC  [5-1734592-0]
J5  USB A Receptacle  [USB A Socket]
J6  123-34-2234_7  [Header 2x16 male]
J7  USB A Receptacle  [USB A Socket]
J8  USB micro  [USB micro]
J9  USB micro  [USB micro]
J10  JST 1x2  [JST 1x2 2mm]
J11  123-34-2234_11_1  [Header 2x5 male 1.27mm]  (value not drawn)
J12  SD card  [47219-2001]
R92  value 1K  [R0402]  (hidden comment: CRCW04020000Z0ED)
R93  value 1K  [R0402]  (hidden comment: CRCW04020000Z0ED)
R94  value 1K  [R0402]  (hidden comment: CRCW04020000Z0ED)
R95  value 1K  [R0402]  (hidden comment: CRCW04020000Z0ED)
R96  value 1K  [R0402]  (hidden comment: CRCW04020000Z0ED)
R97  value 1K  [R0402]  (hidden comment: CRCW04020000Z0ED)
R98  value 1K  [R0402]  (hidden comment: CRCW04020000Z0ED)
R99  value 1K  [R0402]  (hidden comment: CRCW04020000Z0ED)
R100  value 1K  [R0402]  (hidden comment: CRCW04020000Z0ED)
R101  value 1K  [R0402]  (hidden comment: CRCW04020000Z0ED)
R102  value 1K  [R0402]  (hidden comment: CRCW04020000Z0ED)
R103  value 1K  [R0402]  (hidden comment: CRCW04020000Z0ED)
R104  value 1K  [R0402]  (hidden comment: CRCW04020000Z0ED)
R105  value 1K  [R0402]  (hidden comment: CRCW04020000Z0ED)
R106  value 1K  [R0402]  (hidden comment: CRCW04020000Z0ED)
R107  value 1K  [R0402]  (hidden comment: CRCW04020000Z0ED)
R108  value 0R  [R0402]  (hidden comment: CRCW04020000Z0ED)
R109  value 0R  [R0402]  (hidden comment: CRCW04020000Z0ED)
R110  value 1K  [R0402]  (hidden comment: CRCW04020000Z0ED)
R111  value 1K  [R0603]  (hidden comment: CPF-A-0603B100KE1)
R112  value 10K  [R0402]  (hidden comment: CRCW04020000Z0ED)
R113  value 100K  [R0402]  (hidden comment: CRCW04020000Z0ED)
R114  value 100K  [R0402]  (hidden comment: CRCW04020000Z0ED)
R115  value 100K  [R0402]  (hidden comment: CRCW04020000Z0ED)
R116  value 100K  [R0402]  (hidden comment: CRCW04020000Z0ED)
R117  value 10K  [R0402]  (hidden comment: CRCW04020000Z0ED)
T1  DMG6968U  [DMG6968U]

### Ports
CPU_ERASE (out), CPU_FAN (in), FTDI_USB_1_CON_N (bidir), FTDI_USB_1_CON_P (bidir), FTDI_USB_2_CON_N (bidir), FTDI_USB_2_CON_P (bidir), LCD_BACKLIGHT (in), LCD_CS (in), LCD_D0 (bidir), LCD_D1 (bidir), LCD_D2 (bidir), LCD_D3 (bidir), LCD_D4 (bidir), LCD_D5 (bidir), LCD_D6 (bidir), LCD_D7 (bidir), LCD_D8 (bidir), LCD_D9 (bidir), LCD_D10 (bidir), LCD_D11 (bidir), LCD_D12 (bidir), LCD_D13 (bidir), LCD_D14 (bidir), LCD_D15 (bidir), LCD_DMD_DATA (in), LCD_RE (in), LCD_RESET (in), LCD_WE (in), SD_CLK (bidir), SD_CMD (bidir), SD_DATA0 (bidir), SD_DATA1 (bidir), SD_DATA2 (bidir), SD_DATA3 (bidir), SWD_nRST (in), SWD_nRST (out), SWD_SWCLK (bidir), SWD_SWDIO (bidir), SWD_TRACEWO (bidir), USB_DW_1_N (bidir), USB_DW_1_P (bidir), USB_DW_2_N (bidir), USB_DW_2_P (bidir), USB_DW_3_N (bidir), USB_DW_3_P (bidir)

### Nets
+3V3: J4.48 J4.49 J6.3 J6.28 J6.30 J6.32 J11.1 J12.4(VCC) R110.2 R113.2 R114.2 R115.2 R116.2 R117.2
+5V: J3.1(VBUS) J5.1(VBUS) J7.1(VBUS) J8.1(VBUS) R108.2 R109.2 R111.2
GND: J3.4(GND) J4.2 J4.7 J4.12 J4.17 J4.22 J4.27 J4.32 J4.50 J4.51 J5.4(GND) J6.1 J6.27 J6.29 J6.31 J7.4(GND) J8.5(GND) J9.5(GND) J11.3 J11.5 J12.6(GND) R112.1 T1.2(S)
DRAM_D0: R92.2 ; port LCD_D0
DRAM_D1: R93.2 ; port LCD_D1
DRAM_D2: R94.2 ; port LCD_D2
DRAM_D3: R95.2 ; port LCD_D3
DRAM_D4: R96.2 ; port LCD_D4
DRAM_D5: R97.2 ; port LCD_D5
DRAM_D6: R98.2 ; port LCD_D6
DRAM_D7: R99.2 ; port LCD_D7
DRAM_D8: R100.2 ; port LCD_D8
DRAM_D9: R101.2 ; port LCD_D9
DRAM_D10: R102.2 ; port LCD_D10
DRAM_D11: R103.2 ; port LCD_D11
DRAM_D12: R104.2 ; port LCD_D12
DRAM_D13: R105.2 ; port LCD_D13
DRAM_D14: R107.2 ; port LCD_D15
DRAM_D15: R106.2 ; port LCD_D14
FTDI_USB_1_N: J8.2(D-) ; port FTDI_USB_1_CON_N
FTDI_USB_1_P: J8.3(D+) ; port FTDI_USB_1_CON_P
FTDI_USB_2_N: J9.2(D-) ; port FTDI_USB_2_CON_N
FTDI_USB_2_P: J9.3(D+) ; port FTDI_USB_2_CON_P
LCD_BACKLIGHT: J4.46 ; port LCD_BACKLIGHT
LCD_CMD_DATA: J4.33 ; port LCD_DMD_DATA
LCD_CS: J4.34 ; port LCD_CS
LCD_D0: J4.3 R92.1
LCD_D1: J4.4 R93.1
LCD_D2: J4.5 R94.1
LCD_D3: J4.6 R95.1
LCD_D4: J4.8 R96.1
LCD_D5: J4.9 R97.1
LCD_D6: J4.10 R98.1
LCD_D7: J4.11 R99.1
LCD_D8: J4.13 R100.1
LCD_D9: J4.14 R101.1
LCD_D10: J4.15 R102.1
LCD_D11: J4.16 R103.1
LCD_D12: J4.18 R104.1
LCD_D13: J4.19 R105.1
LCD_D14: J4.20 R106.1
LCD_D15: J4.21 R107.1
LCD_RE: J4.36 ; port LCD_RE
LCD_RESET: J4.47 ; port LCD_RESET
LCD_WE: J4.35 ; port LCD_WE
USB_DOWN_1_N: J3.2(D-) ; port USB_DW_1_N
USB_DOWN_1_P: J3.3(D+) ; port USB_DW_1_P
USB_DOWN_2_N: J5.2(D-) ; port USB_DW_2_N
USB_DOWN_2_P: J5.3(D+) ; port USB_DW_2_P
USB_DOWN_3_N: J7.2(D-) ; port USB_DW_3_N
USB_DOWN_3_P: J7.3(D+) ; port USB_DW_3_P
NetJ4_24: J4.24 R108.1
NetJ4_25: J4.25 R109.1
NetJ4_41: J4.41 R110.1
NetJ6_2: J6.2 J11.10 ; port SWD_nRST
NetJ6_4: J6.4 ; port CPU_ERASE
NetJ10_1: J10.1 R111.1
NetJ10_2: J10.2 T1.3(D)
NetJ11_2: J11.2 ; port SWD_SWDIO
NetJ11_4: J11.4 ; port SWD_SWCLK
NetJ11_6: J11.6 ; port SWD_TRACEWO
NetJ12_1: J12.1(DAT2) R115.1 ; port SD_DATA2
NetJ12_2: J12.2(CD_/_DAT3) R116.1 ; port SD_DATA3
NetJ12_3: J12.3(CMD) R117.1 ; port SD_CMD
NetJ12_5: J12.5(CLK) ; port SD_CLK
NetJ12_7: J12.7(DAT0) R113.1 ; port SD_DATA0
NetJ12_8: J12.8(DAT1) R114.1 ; port SD_DATA1
NetR112_2: R112.2 T1.1(G) ; port CPU_FAN

Not connected (* = marked no-connect by the designer): J4 1(55)* 23(77)* 26(80)* 28(82)* 29(83)* 30(84)* 31(85)* 37(91)* 38(92)* 39(93)* 40(94)* 42(96) 43(97) 44(98) 45(99); J6 5 6 7 8 9 10 11 12 13 14 15 16 17 18 19 20 21 22 23 24 25 26; J8 4(ID)*; J9 1(VBUS)* 4(ID)*; J11 7* 8* 9*

### Layout directives
net class LCD_DATA: LCD_D0, LCD_D1, LCD_D2, LCD_D3, LCD_D4, LCD_D5, LCD_D6, LCD_D7, LCD_D8, LCD_D9, LCD_D10, LCD_D11, LCD_D12, LCD_D13, LCD_D14, LCD_D15
net class LCD_CTRL: LCD_BACKLIGHT, LCD_CMD_DATA, LCD_CS, LCD_RE, LCD_RESET, LCD_WE

### Notes on the sheet
- CONNECTORS
- USB HOST
- LCD
- PWR OUT
- GPIO
- PWR IN
- (near J8) USB DEVICE
- (near J12) MICRO SD CARD
- (near J11) DEBUG SWD
- Title
- Size:
- A3
- Number:
- Revision:
- Date:
- File:
- Time:
- Sheet
- of
- (in symbol 5-1734592-0) FFC / FPC 50 pin

### Library data of the parts
J3 J5 J7 = MC32593: USB A; Supplier Part Number 1: 1696534; Supplier 1: Farnell
J4 = 5-1734592-0: FFC / FPC 50 pins 0.5mm pitch; Supplier 1: Farnell; Supplier Part Number 1: 2528036
J6 = 123-34-2234_7: Header 2x16 male 2.54mm
J8 J9 = 47590-0001: USB B micro; Supplier Part Number 1: 1568022; Supplier 1: Farnell
J10 = 02P-SJN: JST 1x2 2mm female
J11 = 123-34-2234_11_1: Header 2x5 male 1.27mm
J12 = 47219-2001: SD micro card; Supplier Part Number 1: 2614940; Supplier 1: Farnell
R92-R110 R112-R117 = CRCW04020000Z0ED: R0402
R111 = CPF-A-0603B100KE1: R0603
T1 = DMG6968U: NMOS 6.5A 500mV; Threshold voltage: 500mV; Cont. drain current: 6.5A; Supplier Part Number 1: 1843757; Supplier 1: Farnell